# Altium project mb1225.PrjPCB (part 1 of 4)
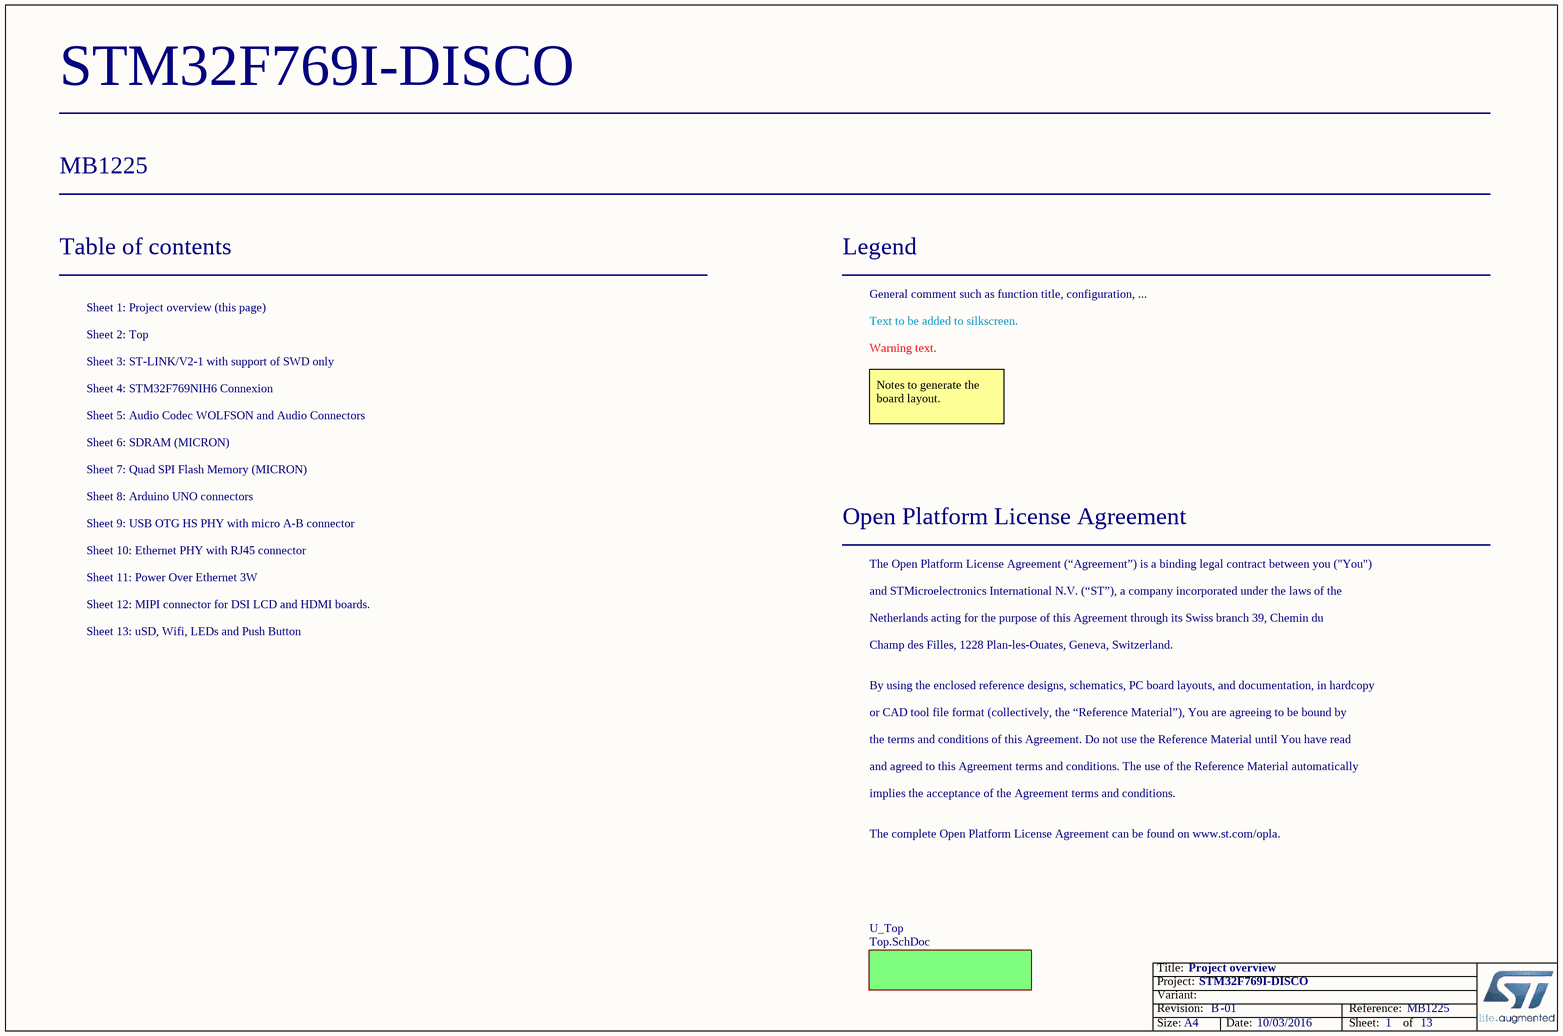
[diagram p0: Project_Overview.SchDoc]
Board_Assembly_Revision: 01; Board_Document_Date: 10/03/2016; Board_name: STM32F769I-DISCO; Board_PCB_Revision: B; Board_reference: MB1225
13 sheets, 452 parts. Net scope: flat (ports and power ports of the same name join across sheets).
Board file: mb1225.PcbDoc
Sheets:
  Project_Overview.SchDoc
    U_Top = Top.SchDoc
      U_ST_LINK_V2-1 = ST_LINK_V2-1.SCHDOC
      U_AUDIO = AUDIO.SchDoc
      U_Peripherals = Peripherals.SchDoc
      U_QSPI = QSPI.SchDoc
      U_Arduino_ Connectors = Arduino_ Connectors.SchDoc
      U_SDRAM = SDRAM.SchDoc
      U_USB_OTG_HS = USB_OTG_HS.SchDoc
      U_STM32F7 = STM32F7.SchDoc
      U_Ethernet = Ethernet.SchDoc
        U_PoE = PoE.SchDoc
      U_DSI_LCD = DSI_LCD.SchDoc

## Sheet Project_Overview.SchDoc: Project overview
size A4; Date: Not used; ApprovedBy: Not used; CheckedBy: Not used; Author: Not used; CompanyName: STMicroelectronics; DrawnBy: Not used; Engineer: Not used; Organization: Not used; Address1: Not used; Address2: Not used; Address3: Not used; Address4: Not used; DocumentNumber: MB1225; Revision: Not used; SheetNumber: 1; SheetTotal: 13; CurrentTime: Not used; CurrentDate: Not used; Time: Not used; DocumentFullPathAndName: Not used; DocumentName: Not used; ModifiedDate: Not used; ImagePath: Not used; ProjectName: Not used; Application_BuildNumber: Not used

### Sub-sheets
U_Top = Top.SchDoc: no entries

### Notes on the sheet
- Table of contents
- Sheet 1: Project overview (this page)
- Legend
- General comment such as function title, configuration, ...
- Sheet 2: Top
- Sheet 3: ST-LINK/V2-1 with support of SWD only
- Text to be added to silkscreen.
- Warning text.
- Sheet 4: STM32F769NIH6 Connexion
- Sheet 6: SDRAM (MICRON)
- Sheet 5: Audio Codec WOLFSON and Audio Connectors
- Notes to generate the board layout.
- Sheet 7: Quad SPI Flash Memory (MICRON)
- Sheet 8: Arduino UNO connectors
- Sheet 9: USB OTG HS PHY with micro A-B connector
- Sheet 10: Ethernet PHY with RJ45 connector
- Sheet 11: Power Over Ethernet 3W
- Open Platform License Agreement
- The Open Platform License Agreement (“Agreement”) is a binding legal contract between you ("You")
- Sheet 12: MIPI connector for DSI LCD and HDMI boards.
- Sheet 13: uSD, Wifi, LEDs and Push Button
- and STMicroelectronics International N.V. (“ST”), a company incorporated under the laws of the
- Netherlands acting for the purpose of this Agreement through its Swiss branch 39, Chemin du
- Champ des Filles, 1228 Plan-les-Ouates, Geneva, Switzerland.
- By using the enclosed reference designs, schematics, PC board layouts, and documentation, in hardcopy
- or CAD tool file format (collectively, the “Reference Material”), You are agreeing to be bound by
- the terms and conditions of this Agreement. Do not use the Reference Material until You have read
- and agreed to this Agreement terms and conditions. The use of the Reference Material automatically
- implies the acceptance of the Agreement terms and conditions.
- The complete Open Platform License Agreement can be found on www.st.com/opla.
- Title:
- Project:
- Size:
- Revision:
- Variant:
- A4
- -
- Date:
- Reference:
- Sheet:
- of

## Sheet Top.SchDoc: STM32F769 Discovery Interconnexion
size A4; Date: 29-OCT-2015; Author: A.B; CompanyName: STMicroelectronics; Organization: MCD/TOOLS/GNB; Address1: 12, Rue Jules HOROWITZ; Address2: 38019 Grenoble; Address3: FRANCE; DocumentNumber: MB1225; Revision: B-01; SheetNumber: 2; SheetTotal: 13; Project: STM32F769I-DISCO
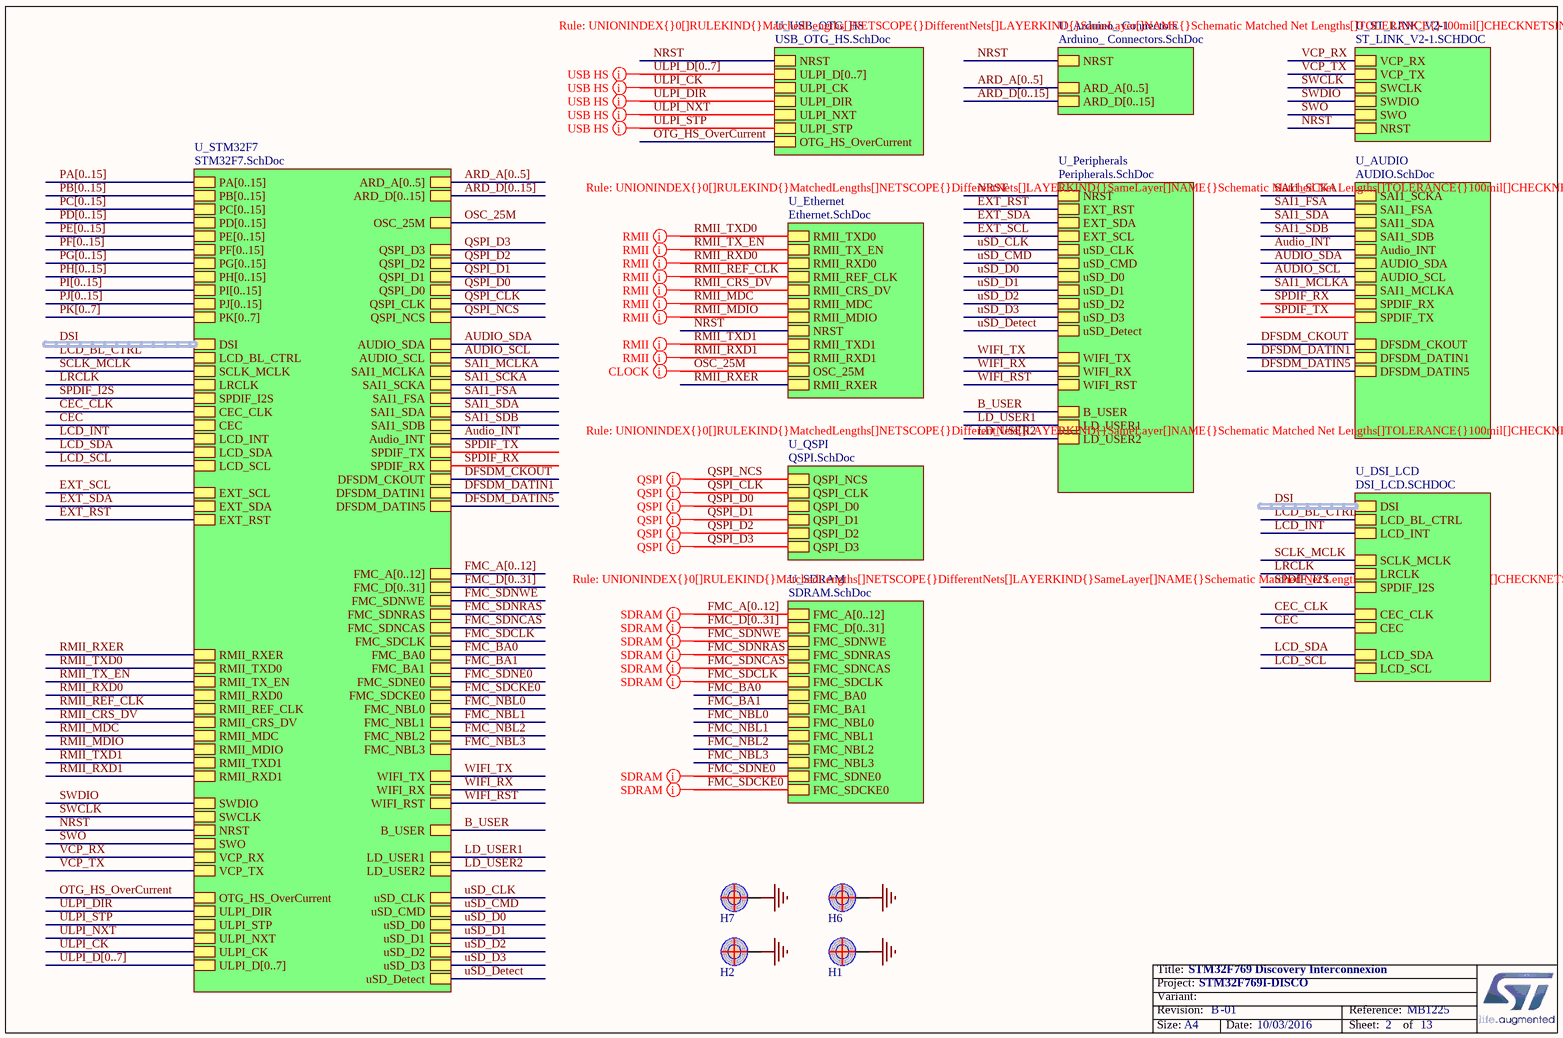
[diagram p1: Top.SchDoc]

### Parts
H1  POSITION HOLE C6D3R5  [HOLE_C6D3R5]  (value not drawn)
H2  POSITION HOLE C6D3R5  [HOLE_C6D3R5]  (value not drawn)
H6  POSITION HOLE C6D3R5  [HOLE_C6D3R5]  (value not drawn)
H7  POSITION HOLE C6D3R5  [HOLE_C6D3R5]  (value not drawn)

### Sub-sheets
U_Arduino_ Connectors = Arduino_ Connectors.SchDoc: NRST, ARD_D[0..15], ARD_A[0..5]
U_AUDIO = AUDIO.SchDoc: AUDIO_SDA, AUDIO_SCL, SAI1_MCLKA, SPDIF_RX, SAI1_SCKA, SAI1_FSA, SAI1_SDA, SAI1_SDB, Audio_INT, SPDIF_TX, DFSDM_CKOUT, DFSDM_DATIN1, DFSDM_DATIN5
U_DSI_LCD = DSI_LCD.SCHDOC: DSI (harness DSI), LCD_INT, LCD_BL_CTRL, SCLK_MCLK, LRCLK, SPDIF_I2S, CEC_CLK, CEC, LCD_SDA, LCD_SCL
U_Ethernet = Ethernet.SchDoc: RMII_TXD0, RMII_TX_EN, RMII_RXD0, RMII_REF_CLK, RMII_CRS_DV, RMII_MDC, RMII_MDIO, NRST, RMII_TXD1, RMII_RXD1, OSC_25M, RMII_RXER
U_Peripherals = Peripherals.SchDoc: NRST, EXT_RST, EXT_SCL, EXT_SDA, uSD_CLK, uSD_CMD, uSD_D0, uSD_D1, uSD_D2, uSD_D3, uSD_Detect, B_USER, WIFI_TX, WIFI_RX, WIFI_RST, LD_USER1, LD_USER2
U_QSPI = QSPI.SchDoc: QSPI_D0, QSPI_D3, QSPI_D1, QSPI_CLK, QSPI_NCS, QSPI_D2
U_SDRAM = SDRAM.SchDoc: FMC_A[0..12], FMC_SDNWE, FMC_SDNRAS, FMC_SDNCAS, FMC_SDCLK, FMC_BA0, FMC_BA1, FMC_NBL0, FMC_NBL1, FMC_SDNE0, FMC_SDCKE0, FMC_D[0..31], FMC_NBL2, FMC_NBL3
U_ST_LINK_V2-1 = ST_LINK_V2-1.SCHDOC: SWDIO, SWCLK, NRST, VCP_RX, VCP_TX, SWO
U_STM32F7 = STM32F7.SchDoc: PA[0..15], PB[0..15], PC[0..15], PD[0..15], PE[0..15], PF[0..15], PG[0..15], PH[0..15], PI[0..15], PJ[0..15], PK[0..7], OSC_25M, RMII_TXD0, RMII_TX_EN, RMII_RXD0, RMII_REF_CLK, RMII_CRS_DV, RMII_MDC, RMII_MDIO, RMII_TXD1, RMII_RXD1, ULPI_D[0..7], ULPI_CK, ULPI_DIR, ULPI_NXT, ULPI_STP, QSPI_D0, QSPI_D3, QSPI_D1, QSPI_CLK, QSPI_NCS, AUDIO_SDA, AUDIO_SCL, SAI1_MCLKA, EXT_SCL, EXT_SDA, EXT_RST, uSD_CLK, uSD_CMD, uSD_D0, uSD_D1, uSD_D2, uSD_D3, uSD_Detect, SWDIO, SWCLK, NRST, SWO, VCP_RX, VCP_TX, FMC_A[0..12], FMC_D[0..31], FMC_SDNWE, FMC_SDNRAS, FMC_SDNCAS, FMC_SDCLK, FMC_BA0, FMC_BA1, FMC_SDNE0, FMC_SDCKE0, FMC_NBL0, FMC_NBL1, SPDIF_RX, QSPI_D2, B_USER, ARD_D[0..15], RMII_RXER, OTG_HS_OverCurrent, SAI1_SCKA, SAI1_FSA, SAI1_SDA, SAI1_SDB, Audio_INT, SPDIF_TX, FMC_NBL2, FMC_NBL3, DSI (harness DSI), LCD_BL_CTRL, SCLK_MCLK, LRCLK, SPDIF_I2S, CEC_CLK, CEC, LCD_INT, LCD_SDA, LCD_SCL, WIFI_RST, WIFI_RX, WIFI_TX, ARD_A[0..5], LD_USER1, LD_USER2, DFSDM_CKOUT, DFSDM_DATIN1, DFSDM_DATIN5
U_USB_OTG_HS = USB_OTG_HS.SchDoc: ULPI_D[0..7], ULPI_CK, ULPI_DIR, ULPI_NXT, ULPI_STP, NRST, OTG_HS_OverCurrent

### Nets
GND: H1.1 H2.1 H6.1 H7.1  [project net POE7]
Audio_INT: sheet U_AUDIO/Audio_INT, sheet U_STM32F7/Audio_INT
AUDIO_SCL: sheet U_AUDIO/AUDIO_SCL, sheet U_STM32F7/AUDIO_SCL
AUDIO_SDA: sheet U_AUDIO/AUDIO_SDA, sheet U_STM32F7/AUDIO_SDA
B_USER: sheet U_Peripherals/B_USER, sheet U_STM32F7/B_USER
CEC: sheet U_STM32F7/CEC, sheet U_DSI_LCD/CEC
CEC_CLK: sheet U_STM32F7/CEC_CLK, sheet U_DSI_LCD/CEC_CLK
DFSDM_CKOUT: sheet U_AUDIO/DFSDM_CKOUT, sheet U_STM32F7/DFSDM_CKOUT
DFSDM_DATIN1: sheet U_AUDIO/DFSDM_DATIN1, sheet U_STM32F7/DFSDM_DATIN1
DFSDM_DATIN5: sheet U_AUDIO/DFSDM_DATIN5, sheet U_STM32F7/DFSDM_DATIN5
EXT_RST: sheet U_Peripherals/EXT_RST, sheet U_STM32F7/EXT_RST
EXT_SCL: sheet U_Peripherals/EXT_SCL, sheet U_STM32F7/EXT_SCL
EXT_SDA: sheet U_Peripherals/EXT_SDA, sheet U_STM32F7/EXT_SDA
FMC_BA0: sheet U_SDRAM/FMC_BA0, sheet U_STM32F7/FMC_BA0
FMC_BA1: sheet U_SDRAM/FMC_BA1, sheet U_STM32F7/FMC_BA1
FMC_NBL0: sheet U_SDRAM/FMC_NBL0, sheet U_STM32F7/FMC_NBL0
FMC_NBL1: sheet U_SDRAM/FMC_NBL1, sheet U_STM32F7/FMC_NBL1
FMC_NBL2: sheet U_SDRAM/FMC_NBL2, sheet U_STM32F7/FMC_NBL2
FMC_NBL3: sheet U_SDRAM/FMC_NBL3, sheet U_STM32F7/FMC_NBL3
FMC_SDCKE0: sheet U_SDRAM/FMC_SDCKE0, sheet U_STM32F7/FMC_SDCKE0
FMC_SDCLK: sheet U_SDRAM/FMC_SDCLK, sheet U_STM32F7/FMC_SDCLK
FMC_SDNCAS: sheet U_SDRAM/FMC_SDNCAS, sheet U_STM32F7/FMC_SDNCAS
FMC_SDNE0: sheet U_SDRAM/FMC_SDNE0, sheet U_STM32F7/FMC_SDNE0
FMC_SDNRAS: sheet U_SDRAM/FMC_SDNRAS, sheet U_STM32F7/FMC_SDNRAS
FMC_SDNWE: sheet U_SDRAM/FMC_SDNWE, sheet U_STM32F7/FMC_SDNWE
LCD_BL_CTRL: sheet U_STM32F7/LCD_BL_CTRL, sheet U_DSI_LCD/LCD_BL_CTRL
LCD_INT: sheet U_STM32F7/LCD_INT, sheet U_DSI_LCD/LCD_INT
LCD_SCL: sheet U_STM32F7/LCD_SCL, sheet U_DSI_LCD/LCD_SCL
LCD_SDA: sheet U_STM32F7/LCD_SDA, sheet U_DSI_LCD/LCD_SDA
LD_USER1: sheet U_Peripherals/LD_USER1, sheet U_STM32F7/LD_USER1
LD_USER2: sheet U_Peripherals/LD_USER2, sheet U_STM32F7/LD_USER2
LRCLK: sheet U_STM32F7/LRCLK, sheet U_DSI_LCD/LRCLK
NRST: sheet U_ST_LINK_V2-1/NRST, sheet U_Peripherals/NRST, sheet U_Arduino_ Connectors/NRST, sheet U_USB_OTG_HS/NRST, sheet U_STM32F7/NRST, sheet U_Ethernet/NRST
OSC_25M: sheet U_STM32F7/OSC_25M, sheet U_Ethernet/OSC_25M
OTG_HS_OverCurrent: sheet U_USB_OTG_HS/OTG_HS_OverCurrent, sheet U_STM32F7/OTG_HS_OverCurrent
QSPI_CLK: sheet U_QSPI/QSPI_CLK, sheet U_STM32F7/QSPI_CLK
QSPI_D0: sheet U_QSPI/QSPI_D0, sheet U_STM32F7/QSPI_D0
QSPI_D1: sheet U_QSPI/QSPI_D1, sheet U_STM32F7/QSPI_D1
QSPI_D2: sheet U_QSPI/QSPI_D2, sheet U_STM32F7/QSPI_D2
QSPI_D3: sheet U_QSPI/QSPI_D3, sheet U_STM32F7/QSPI_D3
QSPI_NCS: sheet U_QSPI/QSPI_NCS, sheet U_STM32F7/QSPI_NCS
RMII_CRS_DV: sheet U_STM32F7/RMII_CRS_DV, sheet U_Ethernet/RMII_CRS_DV
RMII_MDC: sheet U_STM32F7/RMII_MDC, sheet U_Ethernet/RMII_MDC
RMII_MDIO: sheet U_STM32F7/RMII_MDIO, sheet U_Ethernet/RMII_MDIO
RMII_REF_CLK: sheet U_STM32F7/RMII_REF_CLK, sheet U_Ethernet/RMII_REF_CLK
RMII_RXD0: sheet U_STM32F7/RMII_RXD0, sheet U_Ethernet/RMII_RXD0
RMII_RXD1: sheet U_STM32F7/RMII_RXD1, sheet U_Ethernet/RMII_RXD1
RMII_RXER: sheet U_STM32F7/RMII_RXER, sheet U_Ethernet/RMII_RXER
RMII_TX_EN: sheet U_STM32F7/RMII_TX_EN, sheet U_Ethernet/RMII_TX_EN
RMII_TXD0: sheet U_STM32F7/RMII_TXD0, sheet U_Ethernet/RMII_TXD0
RMII_TXD1: sheet U_STM32F7/RMII_TXD1, sheet U_Ethernet/RMII_TXD1
SAI1_FSA: sheet U_AUDIO/SAI1_FSA, sheet U_STM32F7/SAI1_FSA
SAI1_MCLKA: sheet U_AUDIO/SAI1_MCLKA, sheet U_STM32F7/SAI1_MCLKA
SAI1_SCKA: sheet U_AUDIO/SAI1_SCKA, sheet U_STM32F7/SAI1_SCKA
SAI1_SDA: sheet U_AUDIO/SAI1_SDA, sheet U_STM32F7/SAI1_SDA
SAI1_SDB: sheet U_AUDIO/SAI1_SDB, sheet U_STM32F7/SAI1_SDB
SCLK_MCLK: sheet U_STM32F7/SCLK_MCLK, sheet U_DSI_LCD/SCLK_MCLK
SPDIF_I2S: sheet U_STM32F7/SPDIF_I2S, sheet U_DSI_LCD/SPDIF_I2S
SPDIF_RX: sheet U_AUDIO/SPDIF_RX, sheet U_STM32F7/SPDIF_RX
SPDIF_TX: sheet U_AUDIO/SPDIF_TX, sheet U_STM32F7/SPDIF_TX
SWCLK: sheet U_ST_LINK_V2-1/SWCLK, sheet U_STM32F7/SWCLK
SWDIO: sheet U_ST_LINK_V2-1/SWDIO, sheet U_STM32F7/SWDIO
SWO: sheet U_ST_LINK_V2-1/SWO, sheet U_STM32F7/SWO
ULPI_CK: sheet U_USB_OTG_HS/ULPI_CK, sheet U_STM32F7/ULPI_CK
ULPI_DIR: sheet U_USB_OTG_HS/ULPI_DIR, sheet U_STM32F7/ULPI_DIR
ULPI_NXT: sheet U_USB_OTG_HS/ULPI_NXT, sheet U_STM32F7/ULPI_NXT
ULPI_STP: sheet U_USB_OTG_HS/ULPI_STP, sheet U_STM32F7/ULPI_STP
uSD_CLK: sheet U_Peripherals/uSD_CLK, sheet U_STM32F7/uSD_CLK
uSD_CMD: sheet U_Peripherals/uSD_CMD, sheet U_STM32F7/uSD_CMD
uSD_D0: sheet U_Peripherals/uSD_D0, sheet U_STM32F7/uSD_D0
uSD_D1: sheet U_Peripherals/uSD_D1, sheet U_STM32F7/uSD_D1
uSD_D2: sheet U_Peripherals/uSD_D2, sheet U_STM32F7/uSD_D2
uSD_D3: sheet U_Peripherals/uSD_D3, sheet U_STM32F7/uSD_D3
uSD_Detect: sheet U_Peripherals/uSD_Detect, sheet U_STM32F7/uSD_Detect
VCP_RX: sheet U_ST_LINK_V2-1/VCP_RX, sheet U_STM32F7/VCP_RX
VCP_TX: sheet U_ST_LINK_V2-1/VCP_TX, sheet U_STM32F7/VCP_TX
WIFI_RST: sheet U_Peripherals/WIFI_RST, sheet U_STM32F7/WIFI_RST
WIFI_RX: sheet U_Peripherals/WIFI_RX, sheet U_STM32F7/WIFI_RX
WIFI_TX: sheet U_Peripherals/WIFI_TX, sheet U_STM32F7/WIFI_TX

### Buses and harness runs
bus ARD_A[0..5] = sheet U_Arduino_ Connectors/ARD_A[0..5]
bus ARD_A[0..5] = sheet U_STM32F7/ARD_A[0..5]
bus ARD_D[0..15] = sheet U_Arduino_ Connectors/ARD_D[0..15]
bus ARD_D[0..15] = sheet U_STM32F7/ARD_D[0..15]
bus FMC_A[0..12] = sheet U_SDRAM/FMC_A[0..12]
bus FMC_A[0..12] = sheet U_STM32F7/FMC_A[0..12]
bus FMC_D[0..31] = sheet U_SDRAM/FMC_D[0..31]
bus FMC_D[0..31] = sheet U_STM32F7/FMC_D[0..31]
bus PA[0..15] = sheet U_STM32F7/PA[0..15]
bus PB[0..15] = sheet U_STM32F7/PB[0..15]
bus PC[0..15] = sheet U_STM32F7/PC[0..15]
bus PD[0..15] = sheet U_STM32F7/PD[0..15]
bus PE[0..15] = sheet U_STM32F7/PE[0..15]
bus PF[0..15] = sheet U_STM32F7/PF[0..15]
bus PG[0..15] = sheet U_STM32F7/PG[0..15]
bus PH[0..15] = sheet U_STM32F7/PH[0..15]
bus PI[0..15] = sheet U_STM32F7/PI[0..15]
bus PJ[0..15] = sheet U_STM32F7/PJ[0..15]
bus PK[0..7] = sheet U_STM32F7/PK[0..7]
bus ULPI_D[0..7] = sheet U_STM32F7/ULPI_D[0..7]
bus ULPI_D[0..7] = sheet U_USB_OTG_HS/ULPI_D[0..7]
harness DSI = sheet U_DSI_LCD/DSI
harness DSI = sheet U_STM32F7/DSI

### Layout directives
rule Matched Net Lengths [Tolerance = 100mil]: (no net found under the mark), FMC_SDCKE0, FMC_SDCLK, FMC_SDNCAS, FMC_SDNE0, FMC_SDNRAS, FMC_SDNWE, QSPI_CLK, QSPI_D0, QSPI_D1, QSPI_D2, QSPI_D3, QSPI_NCS, RMII_CRS_DV, RMII_MDC, RMII_MDIO, RMII_REF_CLK, RMII_RXD0, RMII_RXD1, RMII_TX_EN, RMII_TXD0, RMII_TXD1, ULPI_CK, ULPI_DIR, ULPI_NXT, ULPI_STP
rule Undefined: OSC_25M

### Notes on the sheet
- Title:
- Project:
- Size:
- Revision:
- Variant:
- A4
- -
- Date:
- Reference:
- Sheet:
- of

## Sheet ST_LINK_V2-1.SCHDOC: ST-LINK/V2-1 with support of SWD only
size A4; Date: 29-OCT-2015; Author: A.B; CompanyName: STMicroelectronics; Organization: MCD/TOOLS/GNB; Address1: 12, Rue Jules HOROWITZ; Address2: 38019 Grenoble; Address3: FRANCE; DocumentNumber: MB1225; Revision: B-01; SheetNumber: 3; SheetTotal: 13; Project: STM32F769I-DISCO
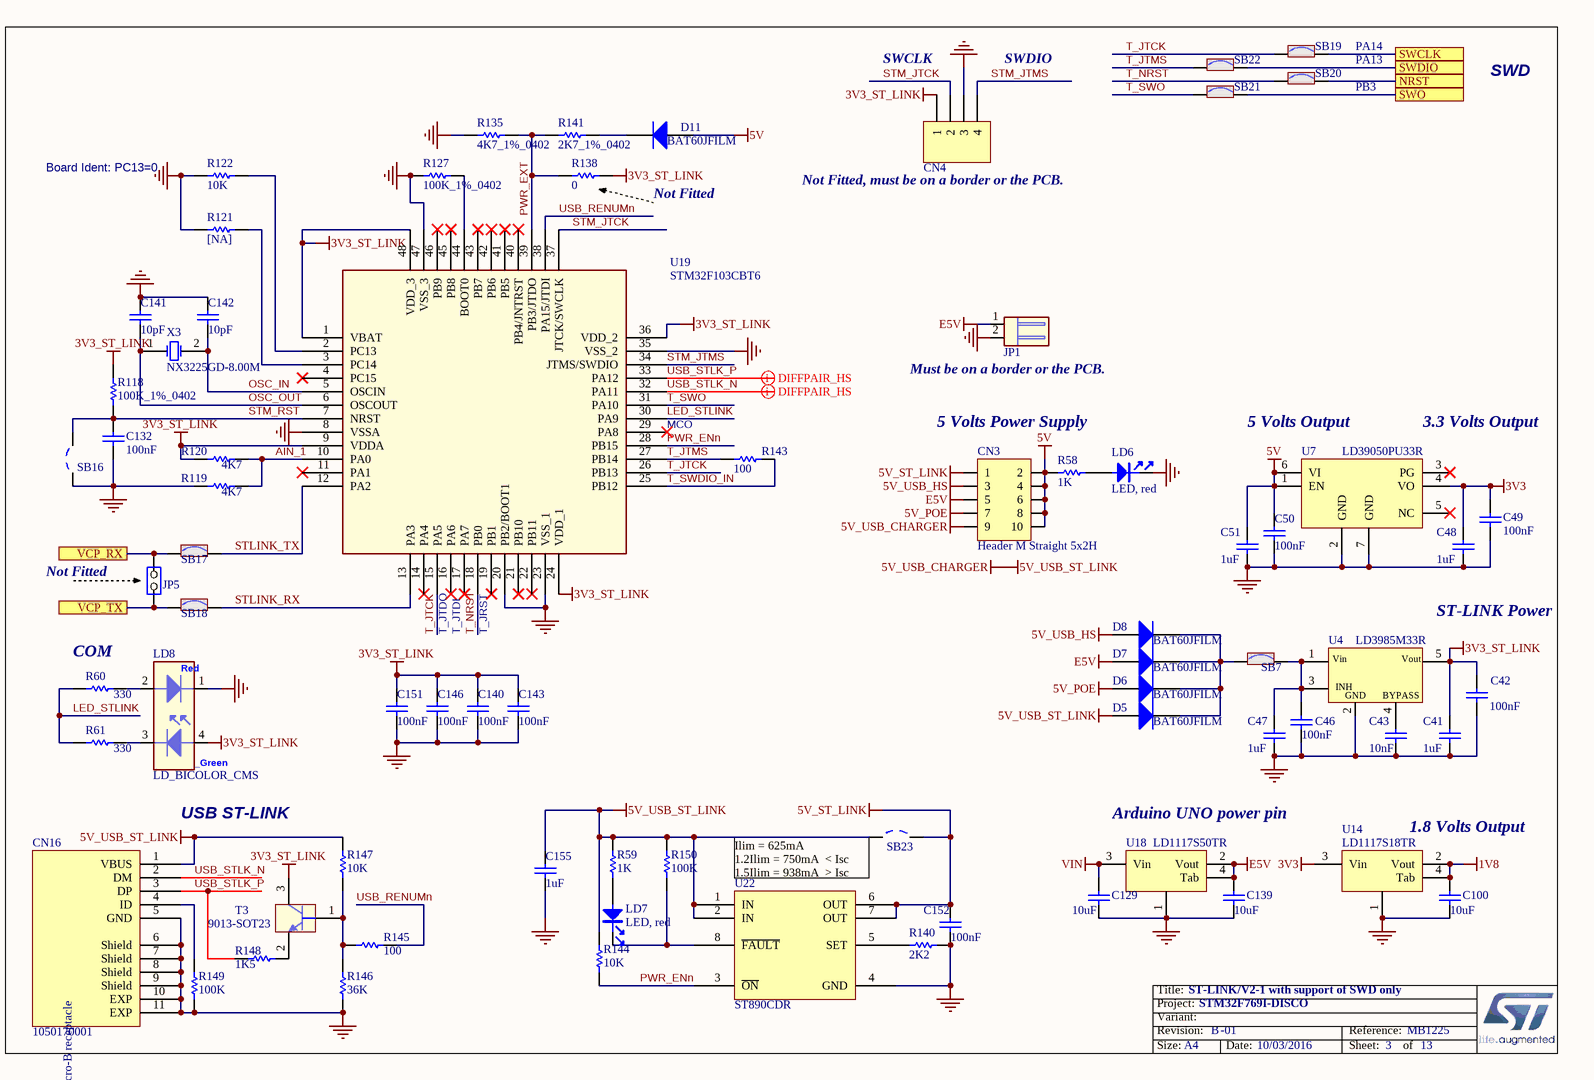
[diagram p2: ST_LINK_V2-1.SCHDOC]

### Parts
C41  1uF  [0603C]
C42  100nF  [0402C]
C43  10nF  [0603C]
C46  100nF  [0402C]
C47  1uF  [0603C]
C48  1uF  [0603C]
C49  100nF  [0402C]
C50  100nF  [0402C]
C51  1uF  [0603C]
C100  10uF  [0603C]
C129  10uF  [0805C]
C132  100nF  [0402C]
C139  10uF  [0805C]
C140  100nF  [0402C]
C141  10pF  [0402C]
C142  10pF  [0402C]
C143  100nF  [0402C]
C146  100nF  [0402C]
C151  100nF  [0402C]
C152  100nF  [0402C]
C155  1uF  [0603C]
CN3  Header M Straight 5x2H  [HDR_2X5_2R54]
CN4  Header 4  [HDR_1X4_2R54]  (value not drawn)
CN16  1050170001  [MICRO_USB_B_105017]
D5  BAT60JFILM  [SOD-323]
D6  BAT60JFILM  [SOD-323]
D7  BAT60JFILM  [SOD-323]
D8  BAT60JFILM  [SOD-323]
D11  BAT60JFILM  [SOD-323]
JP1  WF25402-06421  [HDR_1X2_2R54_RA_11R35]  (value not drawn)
JP5  JP2  [SIP2]  (value not drawn)
LD6  LED, red  [0603D]
LD7  LED, red  [0603D]
LD8  LD_BICOLOR_CMS  [LED2_3528]
R58  1K  [0402R]
R59  1K  [0402R]
R60  330  [0402R]
R61  330  [0402R]
R118  100K_1%_0402  [0402R]
R119  4K7  [0402R]
R120  4K7  [0402R]
R121  [NA]  [0402R]
R122  10K  [0402R]
R127  100K_1%_0402  [0402R]
R135  4K7_1%_0402  [0402R]
R138  0  [0402R]
R140  2K2  [0402R]
R141  2K7_1%_0402  [0402R]
R143  100  [0402R]
R144  10K  [0402R]
R145  100  [0402R]
R146  36K  [0402R]
R147  10K  [0402R]
R148  1K5  [0402R]
R149  100K  [0402R]
R150  100K  [0402R]
SB7  Solder Bridge ON  [JP2_SMD]  (value not drawn)
SB16  Solder Bridge OFF  [JP2_SMD]  (value not drawn)
SB17  Solder Bridge ON  [JP2_SMD]  (value not drawn)
SB18  Solder Bridge ON  [JP2_SMD]  (value not drawn)
SB19  Solder Bridge ON  [JP2_SMD]  (value not drawn)
SB20  Solder Bridge ON  [JP2_SMD]  (value not drawn)
SB21  Solder Bridge ON  [JP2_SMD]  (value not drawn)
SB22  Solder Bridge ON  [JP2_SMD]  (value not drawn)
SB23  Solder Bridge OFF  [JP2_SMD]  (value not drawn)
T3  9013-SOT23  [SOT-23]
U4  LD3985M33R  [SOT-23-5L]
U7  LD39050PU33R  [DFN6_0R95_3X3]
U14  LD1117S18TR  [SOT-223]
U18  LD1117S50TR  [SOT-223]
U19  STM32F103CBT6  [LQFP48_0R5_9X9]
U22  ST890CDR  [SOIC8_1R27_4R9X6]
X3  NX3225GD-8.00M  [XTAL_2SM_3R2X2R5_H1]

### Ports
NRST, SWCLK, SWDIO, SWO, VCP_RX, VCP_TX

### Nets
1V8: C100.2 U14.2(Vout) U14.4(Tab)
3V3: C48.2 C49.2 U7.4(VO) U14.3(Vin)
3V3_ST_LINK: C41.1 C42.2 C140.1 C143.2 C146.2 C151.2 CN4.1 LD8.4 R118.2 R120.1 R138.2 T3.3(C) U4.5(Vout) U19.1(VBAT) U19.9(VDDA) U19.24(VDD_1) U19.36(VDD_2) U19.48(VDD_3)
5V: C50.2 C51.2 CN3.2 CN3.4 CN3.6 CN3.8 CN3.10 D11.1(A) R58.1 U7.1(EN) U7.6(VI)
5V_POE: CN3.7 D6.1(A)
5V_ST_LINK: C152.2 CN3.1 SB23.2 U22.6(OUT) U22.7(OUT)
5V_USB_CHARGER: C155.2 CN3.9 CN16.1(VBUS) D5.1(A) R59.2 R144.2 R147.2 R150.2 SB23.1 U22.1(IN) U22.2(IN)  [also labelled 5V_USB_ST_LINK]
5V_USB_HS: CN3.3 D8.1(A)
E5V: C139.2 CN3.5 D7.1(A) JP1.1 U18.2(Vout) U18.4(Tab)
GND: C41.2 C42.1 C43.1 C46.1 C47.1 C48.1 C49.1 C50.1 C51.1 C100.1 C129.1 C132.1 C139.1 C140.2 C141.1 C142.1 C143.1 C146.1 C151.1 C152.1 C155.1 CN4.3 CN16.5(GND) CN16.6(Shield) CN16.7(Shield) CN16.8(Shield) CN16.9(Shield) CN16.10(EXP) CN16.11(EXP) JP1.2 LD6.2 LD8.1 R119.1 R121.1 R122.1 R127.1 R135.1 R140.2 R146.1 R149.1 SB16.1 U4.2(GND) U7.2(GND) U7.7(GND) U14.1 U18.1 U19.8(VSSA) U19.20(PB2/BOOT1) U19.23(VSS_1) U19.35(VSS_2) U19.47(VSS_3) U22.4(GND)  [project net POE7]
VIN: C129.2 U18.3(Vin)
AIN_1: R119.2 R120.2 U19.10(PA0)
LED_STLINK: R60.1 R61.1 U19.30(PA9)
NRST: SB20.2 ; port NRST
OSC_IN: C142.2 U19.5(OSCIN) X3.2(OSC2)
OSC_OUT: C141.2 U19.6(OSCOUT) X3.1(OSC1)
PA9: JP5.1(COMMON) SB18.1 ; port VCP_TX
PA10: JP5.2(NO) SB17.1 ; port VCP_RX
PA13: SB22.2 ; port SWDIO
PA14: SB19.2 ; port SWCLK
PWR_ENn: R144.1 U19.28(PB15) U22.3(~{ON})
PWR_EXT: R135.2 R138.1 R141.1 U19.39(PB3/JTDO)
STLINK_RX: SB18.2 U19.13(PA3)
STLINK_TX: SB17.2 U19.12(PA2)
STM_JTCK: CN4.2 U19.37(JTCK/SWCLK)
STM_JTMS: CN4.4 U19.34(JTMS/SWDIO)
STM_RST: C132.2 R118.1 SB16.2 U19.7(NRST)
SWO: SB21.2 ; port SWO
T_JTCK: SB19.1 U19.15(PA5) U19.26(PB13)
T_JTMS: R143.1 SB22.1 U19.27(PB14)
T_NRST: SB20.1 U19.18(PB0)
T_SWDIO_IN: R143.2 U19.25(PB12)
T_SWO: SB21.1 U19.31(PA10)
USB_RENUMn: R145.2 U19.38(PA15/JTDI)
USB_STLK_N: CN16.2(DM) U19.32(PA11)
USB_STLK_P: CN16.3(DP) R148.1 U19.33(PA12)
NetC43_2: C43.2 U4.4(BYPASS)
NetC46_2: C46.2 C47.2 SB7.2 U4.1(Vin) U4.3(CE)
NetCN16_4: CN16.4(ID) R149.2
NetD5_2: D5.2(K) D6.2(K) D7.2(K) D8.2(K) SB7.1
NetD11_2: D11.2(K) R141.2
NetLD6_1: LD6.1 R58.2
NetLD7_1: LD7.1 R59.1
NetLD7_2: LD7.2 R150.1 U22.8(~{FAULT})
NetLD8_2: LD8.2 R60.2
NetLD8_3: LD8.3 R61.2
NetR121_2: R121.2 U19.3(PC14)
NetR122_2: R122.2 U19.2(PC13)
NetR127_2: R127.2 U19.44(BOOT0)
NetR140_1: R140.1 U22.5(SET)
NetR145_1: R145.1 R146.2 R147.1 T3.1(B)
NetR148_2: R148.2 T3.2(E)

Not connected (* = marked no-connect by the designer): U7 3(PG)* 5(NC)*; U19 4(PC15)* 11(PA1)* 14(PA4)* 16(PA6)* 17(PA7)* 19(PB1)* 21(PB10)* 22(PB11)* 29(PA8)* 40(PB4/JNTRST)* 41(PB5)* 42(PB6)* 43(PB7)* 45(PB8)* 46(PB9)*

### Layout directives
differential pair: USB_STLK_N, USB_STLK_P

### Notes on the sheet
- SWCLK
- SWDIO
- PA14
- PA13
- PB3
- SWD
- Board Ident: PC13=0
- Not Fitted
- (near CN4) Not Fitted, must be on a border or the PCB.
- (near JP1) Must be on a border or the PCB.
- MCO
- 5 Volts Power Supply
- (near U7) 5 Volts Output
- (near U7) 3.3 Volts Output
- (near JP5) Not Fitted
- (near R60) COM
- T_JTDO
- T_JTDI
- T_JRST
- ST-LINK Power
- USB ST-LINK
- (near SB23) Ilim = 625mA
  1.2Ilim = 750mA  < Isc
  1.5Ilim = 938mA  > Isc
- Arduino UNO power pin
- (near U14) 1.8 Volts Output
- Title:
- Project:
- Size:
- Revision:
- Variant:
- A4
- -
- Date:
- Reference:
- Sheet:
- of
- (in symbol 1050170001) USB_Micro-B receptacle
- (in symbol LD3985M33R) INH
- (in symbol LD_BICOLOR_CMS) Red; _Green

### Library data of the parts
C41 C47 C48 C51 C155 = Cap_1uF_X5R_10%_0603: Capacitor,1uF,16V,X5R,10%,0603,YAGEO; Manuf_Part_1: CC0603KRX5R7BB105; Revision: July-2002: Re-released for DXP Platform.; Value: 1uF; Order: CC0603KRX5R7BB105; Manuf_1: YAGEO
  C155: ECCN_US/EU: n/a
C42 C46 C49 C50 C132 C140 C143 C146 C151 C152 = Cap_100nF_X7R_10%_0402: Capacitor,100nF,16V,X7R,10%,0402,YAGEO; Manuf_Part_1: CC0402KRX7R7BB104; Revision: July-2002: Re-released for DXP Platform.; Value: 100nF; Order: CC0402KRX7R7BB104; Manuf_1: YAGEO
C43 = Cap_10nF_X7R_10%_0603: Capacitor,10nF,50V,X7R,10%,0603,YAGEO; Manuf_Part_1: CC0603KRX7R9BB103; Revision: July-2002: Re-released for DXP Platform.; Value: 10nF; Order: CC0603KRX7R9BB103; Manuf_1: YAGEO
C100 = Cap_10uF_X5R_10%_0603: Capacitor,10uF,6.3V,X5R,10%,0603,YAGEO; Manuf_Part_1: CC0603KRX5R5BB106; Revision: July-2002: Re-released for DXP Platform.; Value: 10uF; Order: CC0603KRX5R5BB106; Manuf_1: YAGEO; ECCN_US/EU: n/a
C129 C139 = Cap_10uF_X5R_10%_0805: Capacitor,10uF,25V,X5R,10%,0805,YAGEO; Manuf_Part_1: CC0805KRX5R8BB106; Revision: July-2002: Re-released for DXP Platform.; Value: 10uF; Order: CC0805KRX5R8BB106; Manuf_1: YAGEO; ECCN_US/EU: n/a
C141 C142 = Cap_10pF_NPO_5%_0402: Capacitor,10pF,50V,NPO,5%,0402,YAGEO; Order: CC0402JRNPO9BN100; Revision: July-2002: Re-released for DXP Platform.; Value: 10pF; Manuf_1: YAGEO; Manuf_Part_1: CC0402JRNPO9BN100; ECCN_US/EU: n/a
CN3 = Header 5X2M: Header Male, 5-Pin, Dual row, Straight, AMD; Manuf_Part_1: 826632-5; Manuf_1: AMD; Distrib: Sub Co; Footprint: HDR2X5H; ECCN_US/EU: n/a; SOFER_FP: HDR_2X5_2R54
CN4 = Header 4: Header, 4-Pin; Fitted: NO; Revision: 17-Jul-2002: Re-released for DXP Platform.; Publisher: Altium Limited; ECCN_US/EU: n/a; SOFER_FP: HDR_1X4_2R54
CN16 = 1050170001: USB-MICRO-B, 1050170001, SMT, MOLEX; ECCN_US/EU: n/a; Manuf_1: MOLEX; Manuf_Part_1: 1050170001; Distrib: DIGIKEY; SOFER_FP: MICRO_USB_B_105017
D5-D8 D11 = BAT60JFILM: Manuf_1: STM; Provided: ST; ECCN_US/EU: EAR99/NEC; Ref St: 9151097; Revision: July-2002: Re-released for DXP Platform.; Order: BAT60JFILM; Manuf_Part_1: BAT60JFILM; Distrib: ST
JP1 = JP2_RA: Header, 2-Pins, Single row, Right Angle, 2.54 mm pitch, DIP; Manuf_1: ATOM; ECCN_US/EU: n/a; Manuf_Part_1: WF25402-06421; Distrib: Sub Co
JP5 = JP2: Fitted: NO; ECCN_US/EU: n/a
LD6 LD7 = LED_red: LED, red, 0603; Manuf_1: everlight; Manuf_Part_1: 19-213-R6C-AP1Q2B/3T; ECCN_US/EU: EAR99/NEC; Order: 19-213-R6C-AP1Q2B/3T
LD8 = LD_BICOLOR_CMS: Bicolor Led; Manuf_Part_1: HSMF-A201-A00J1; Manuf_1: Avago Technologies; Manuf_2: everluck; Manuf_Part_2: LE-RGW35280; Ref St: xxxxxx; ECCN_US/EU: EAR99/NEC; Distrib: RADIOSPARES; Footprint: HSMF-A201
R58 R59 = Res_1K_1%_0402: Resistor,1K,0402,1%,YAGEO; Manuf_Part_1: RC0402FR-071KL; Value: 1K; Manuf_1: YAGEO; Order: RC0402FR-071KL; ECCN_US/EU: n/a
R60 R61 = Res_330_1%_0402: Resistor,330,0402,1%,YAGEO; Manuf_Part_1: RC0402FR-07330RL; Value: 330; ECCN_US/EU: n/a; Manuf_1: YAGEO; Distrib: DIGIKEY; Order: RC0402FR-07330RL
R118 R127 R149 R150 = Res_100K_1%_0402: Resistor,100K,0402,1%,YAGEO; Manuf_Part_1: RC0402FR-07100KL; Manuf_Part_2: RT0402FRE07100KL; Value: 100K; Manuf_1: YAGEO; ECCN_US/EU: n/a; Manuf_2: YAGEO
R119 R120 R135 = Res_4K7_1%_0402: Resistor,4K7,0402,1%,YAGEO; Manuf_Part_1: RC0402FR-074K7L; Manuf_Part_2: RT0402FRE074K7L; Value: 4K7; Manuf_1: YAGEO; ECCN_US/EU: n/a; Manuf_2: YAGEO
R121 = Res_NA_0402: Resistor,[NA],0402; Fitted: NO; Value: [NA]; ECCN_US/EU: n/a
R122 R144 R147 = Res_10K_1%_0402: Resistor,10K,0402,1%,YAGEO; Manuf_Part_1: RC0402FR-0710KL; Value: 10K; Manuf_1: YAGEO; Order: RC0402FR-0710KL; ECCN_US/EU: n/a
R138 = Res_0_5%_0402: Resistor,0,0402,5%,YAGEO; Manuf_Part_1: RC0402JR-070RL; Order: 2363467; Fitted: NO; Value: 0; ECCN_US/EU: n/a; Manuf_1: YAGEO; Distrib: FARNELL
R140 = Res_2K2_1%_0402: Resistor,2K2,0402,1%,YAGEO; Manuf_Part_1: RC0402FR-072K2L; Value: 2K2; Manuf_1: YAGEO; Order: RC0402FR-072K2L; ECCN_US/EU: n/a
R141 = Res_2K7_1%_0402: Resistor,2K7,0402,1%,YAGEO; Manuf_Part_1: RC0402FR-072K7L; Value: 2K7; Manuf_1: YAGEO; Order: RC0402FR-072K7L; ECCN_US/EU: n/a; Distrib: FARNELL
R143 R145 = Res_100_1%_0402: Resistor,100,0402,1%,YAGEO; Manuf_Part_1: RC0402FR-07100RL; Order: 9239111; Value: 100; Manuf_1: YAGEO; ECCN_US/EU: n/a; Distrib: FARNELL
R146 = Res_36K_1%_0402: Resistor,36K,0402,1%,YAGEO; Manuf_Part_1: RC0402FR-0736KL; Value: 36K; Manuf_1: YAGEO; Order: RC0402FR-0736KL; ECCN_US/EU: n/a; Distrib: FARNELL
R148 = Res_1K5_1%_0402: Resistor,1K5,0402,1%,YAGEO; Manuf_Part_1: RC0402FR-071K5L; Value: 1K5; Manuf_1: YAGEO; Order: RC0402FR-071K5L; ECCN_US/EU: n/a; Distrib: FARNELL
SB7 SB17-SB22 = SB_ON: Solder: YES; Revision: July-2002: Re-released for DXP Platform.; ECCN_US/EU: n/a
SB16 SB23 = SB_OFF: Solder: NO; Revision: July-2002: Re-released for DXP Platform.; ECCN_US/EU: n/a
T3 = 9013-SOT23: NPN Bipolar Transistor; Manuf_1: NXP; Manuf_Part_1: BSR14; Order: 1081310; ECCN_US/EU: EAR99/NEC; Revision: July-2002: Re-released for DXP Platform.; Distrib: FARNELL
U4 = LD3985M33R: Ultra low drop-low noise BiCMOS voltage, regulators low ESR capacitors compatible; Manuf_1: STM; Provided: ST; Ref St: 9176161; ECCN_US/EU: EAR99/NEC; Manuf_Part_1: LD3985M33R; Distrib: ST; Order: LD3985M33R
U7 = LD39050P: Ultra low drop-low , 500 mA low quiescent current; Manuf_1: STM; Provided: ST; ECCN_US/EU: EAR99/NEC; Ref St: xxxxxxxx; Distrib: ST; Manuf_Part_1: LD39050PU33R; Order: LD39050PU33R
U14 = LD1117S18TR: LOW DROP FIXED AND ADJUSTABLE POSITIVE VOLTAGE REGULATORS (1.8 Volts); Manuf_1: STM; Ref St: 9176180; ECCN_US/EU: EAR99/NEC; Provided: ST; Manuf_Part_1: LD1117S18TR; Order: LD1117S18TR; Distrib: ST
U18 = LD1117S50TR: IC REG LDO 5V 0.8A SOT223; Manuf_1: STM; Ordered by: ST; ECCN_US/EU: EAR99/NEC; Ref St: 9176133; Manuf_Part_1: LD1117S50TR; Distrib: ST; Order: LD1117S50TR; Provided: ST
U19 = STM32F103CBT6: Medium-density performance line ARM-based 32-bit MCU with 128KB Flash; Manuf_1: STM; Ref St: xxxxxxxx; Provided: ST; ECCN_US/EU: 3A991A2/NEC; Footprint: QFP48 7X7; Manuf_Part_1: STM32F103CBT6; Order: STM32F103CBT6; Distrib: ST
U22 = ST890CDR: 1.2 A current limited high-side power switch with thermal shutdown; Manuf_1: STM; ECCN_US/EU: EAR99/NEC; Provided: ST; Manuf_Part_1: ST890CDR; Distrib: ST; Footprint: SO-8
X3 = XTAL_8M_NX3225GD: Crystal 8Mhz, 8pF, -+50PPM, SMD; Manuf_1: NDK; Manuf_Part_1: NX3225GD 8MHz EXS00A-CG04874; Manuf_Part_2: NX3225GD-8.000M-STD-CRA-3; ECCN_US/EU: EAR99/NEC; NDK Ref: X3127326; Ref St: 9157029; Provided: ST; Order: NX3225GD 8MHz EXS00A-CG04874

## Sheet AUDIO.SchDoc: Audio Codec WOLFSON and Audio Connectors
size A4; Date: 29-OCT-2015; Author: A.B; CompanyName: STMicroelectronics; Organization: MCD/TOOLS/GNB; Address1: 12, Rue Jules HOROWITZ; Address2: 38019 Grenoble; Address3: FRANCE; DocumentNumber: MB1225; Revision: B-01; SheetNumber: 5; SheetTotal: 13; Project: STM32F769I-DISCO
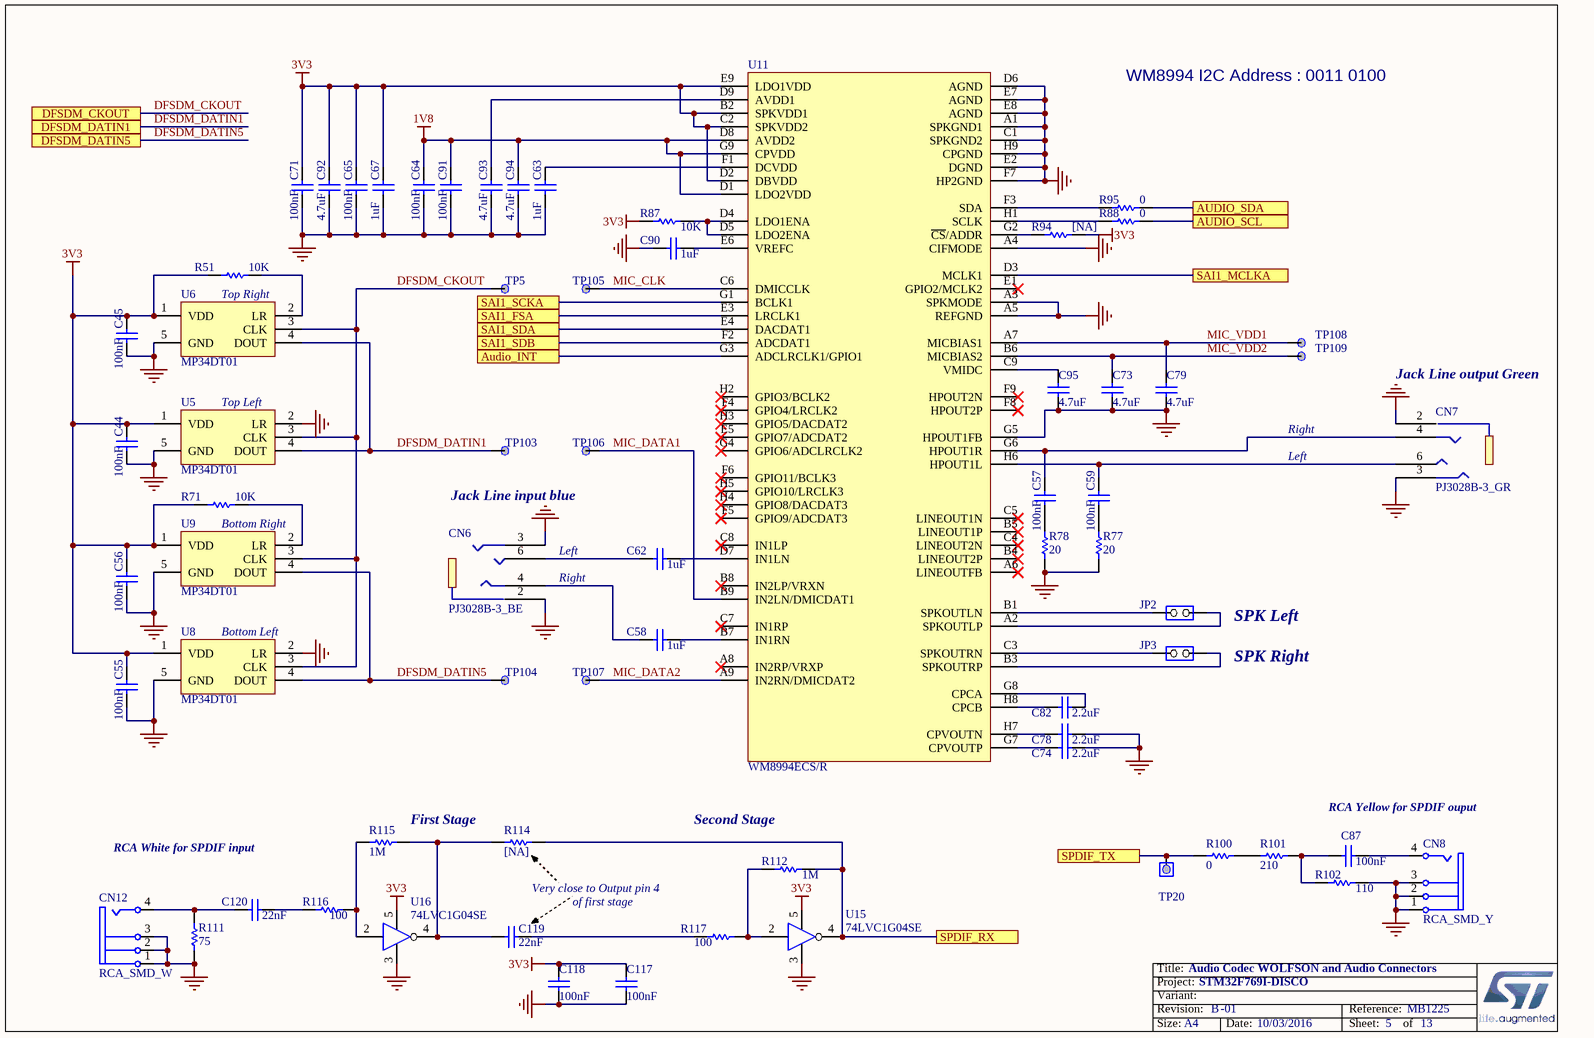
[diagram p3: AUDIO.SchDoc]

### Parts
C44  100nF  [0402C]
C45  100nF  [0402C]
C55  100nF  [0402C]
C56  100nF  [0402C]
C57  100nF  [0402C]
C58  1uF  [0603C]
C59  100nF  [0402C]
C62  1uF  [0603C]
C63  1uF  [0603C]
C64  100nF  [0402C]
C65  100nF  [0402C]
C67  1uF  [0603C]
C71  100nF  [0402C]
C73  4.7uF  [0603C]
C74  2.2uF  [0603C]
C78  2.2uF  [0603C]
C79  4.7uF  [0603C]
C82  2.2uF  [0603C]
C87  100nF  [0402C]
C90  1uF  [0603C]
C91  100nF  [0402C]
C92  4.7uF  [0603C]
C93  4.7uF  [0603C]
C94  4.7uF  [0603C]
C95  4.7uF  [0603C]
C117  100nF  [0402C]
C118  100nF  [0402C]
C119  22nF  [0402C]
C120  22nF  [0402C]
CN6  PJ3028B-3_BE  [PJ3028B]
CN7  PJ3028B-3_GR  [PJ3028B]
CN8  RCA_SMD_Y  [PHONE_JACK_JBB0819100002]
CN12  RCA_SMD_W  [PHONE_JACK_JBB0819100002]
JP2  JP2  [SIP2]  (value not drawn)
JP3  JP2  [SIP2]  (value not drawn)
R51  10K  [0402R]
R71  10K  [0402R]
R77  20  [0402R]
R78  20  [0402R]
R87  10K  [0402R]
R88  0  [0402R]
R94  [NA]  [0402R]
R95  0  [0402R]
R100  0  [0402R]
R101  210  [0402R]
R102  110  [0402R]
R111  75  [0402R]
R112  1M  [0402R]
R114  [NA]  [0402R]
R115  1M  [0402R]
R116  100  [0402R]
R117  100  [0402R]
TP5  TP  [TP_C40]  (value not drawn)
TP20  Test point 1 pin with hole  [TP]  (value not drawn)
TP103  TP  [TP_C40]  (value not drawn)
TP104  TP  [TP_C40]  (value not drawn)
TP105  TP  [TP_C40]  (value not drawn)
TP106  TP  [TP_C40]  (value not drawn)
TP107  TP  [TP_C40]  (value not drawn)
TP108  TP  [TP_C40]  (value not drawn)
TP109  TP  [TP_C40]  (value not drawn)
U5  MP34DT01  [MP34DT01TR]
U6  MP34DT01  [MP34DT01TR]
U8  MP34DT01  [MP34DT01TR]
U9  MP34DT01  [MP34DT01TR]
U11  WM8994ECS/R  [BGA72_0R5_4R5X4]
U15  74LVC1G04SE  [SOT-353]
U16  74LVC1G04SE  [SOT-353]

### Ports
Audio_INT, AUDIO_SCL, AUDIO_SDA, DFSDM_CKOUT, DFSDM_DATIN1, DFSDM_DATIN5, SAI1_FSA, SAI1_MCLKA, SAI1_SCKA, SAI1_SDA, SAI1_SDB, SPDIF_RX, SPDIF_TX

### Nets
1V8: C64.1 C91.1 C94.1 U11.D1(LDO2VDD) U11.D8(AVDD2) U11.G9(CPVDD)
3V3: C44.1 C45.1 C55.1 C56.1 C65.1 C67.2 C71.1 C92.1 C117.2 C118.2 R51.2 R71.2 R87.2 R94.2 U5.1(VDD) U6.1(VDD) U8.1(VDD) U9.1(VDD) U11.B2(SPKVDD1) U11.C2(SPKVDD2) U11.D2(DBVDD) U11.E9(LDO1VDD) U15.5(VCC) U16.5(VCC)
GND: C44.2 C45.2 C55.2 C56.2 C63.1 C64.2 C65.2 C67.1 C71.2 C73.1 C74.2 C78.2 C79.1 C90.2 C91.2 C92.2 C93.2 C94.2 C95.1 C117.1 C118.1 CN6.2 CN6.3 CN7.2 CN7.3 CN8.1(Ground) CN8.2(Ground) CN8.3(Ground) CN12.1(Ground) CN12.2(Ground) CN12.3(Ground) R77.2 R78.2 R102.2 R111.1 U5.2(LR) U5.5(GND) U6.5(GND) U8.2(LR) U8.5(GND) U9.5(GND) U11.A1(SPKGND1) U11.A3(SPKMODE) U11.A4(CIFMODE) U11.A5(REFGND) U11.C1(SPKGND2) U11.D6(AGND) U11.E2(DGND) U11.E7(AGND) U11.E8(AGND) U11.F7(HP2GND) U11.G5(HPOUT1FB) U11.H9(CPGND) U15.3(GND) U16.3(GND)  [project net POE7]
Audio_INT: U11.G3(ADCLRCLK1/GPIO1) ; port Audio_INT
AUDIO_SCL: R88.1 ; port AUDIO_SCL
AUDIO_SDA: R95.1 ; port AUDIO_SDA
DFSDM_CKOUT: TP5.1 U5.3(CLK) U6.3(CLK) U8.3(CLK) U9.3(CLK) ; port DFSDM_CKOUT
DFSDM_DATIN1: TP103.1 U5.4(DOUT) U6.4(DOUT) ; port DFSDM_DATIN1
DFSDM_DATIN5: TP104.1 U8.4(DOUT) U9.4(DOUT) ; port DFSDM_DATIN5
MIC_CLK: TP105.1 U11.C6(DMICCLK)
MIC_DATA1: TP106.1 U11.B9(IN2LN/DMICDAT1)
MIC_DATA2: TP107.1 U11.A9(IN2RN/DMICDAT2)
MIC_VDD1: C79.2 TP108.1 U11.A7(MICBIAS1)
MIC_VDD2: C73.2 TP109.1 U11.B6(MICBIAS2)
PD11: R100.1 TP20.1(COMMON) ; port SPDIF_TX
PE3: U11.F2(ADCDAT1) ; port SAI1_SDB
PE4: U11.E3(LRCLK1) ; port SAI1_FSA
PE5: U11.G1(BCLK1) ; port SAI1_SCKA
PE6: U11.E4(DACDAT1) ; port SAI1_SDA
PG7: U11.D3(MCLK1) ; port SAI1_MCLKA
PG12: R112.2 R114.2 U15.4(Y) ; port SPDIF_RX
NetC57_1: C57.1 CN7.4 U11.G6(HPOUT1R)
NetC57_2: C57.2 R78.1
NetC58_1: C58.1 U11.B7(IN1RN)
NetC58_2: C58.2 CN6.4
NetC59_1: C59.1 CN7.6 U11.H6(HPOUT1L)
NetC59_2: C59.2 R77.1
NetC62_1: C62.1 U11.D7(IN1LN)
NetC62_2: C62.2 CN6.6
NetC63_2: C63.2 U11.F1(DCVDD)
NetC74_1: C74.1 U11.G7(CPVOUTP)
NetC78_1: C78.1 U11.H7(CPVOUTN)
NetC82_1: C82.1 U11.H8(CPCB)
NetC82_2: C82.2 U11.G8(CPCA)
NetC87_1: C87.1 R101.2 R102.1
NetC87_2: C87.2 CN8.4(Signal)
NetC90_1: C90.1 U11.E6(VREFC)
NetC93_1: C93.1 U11.D9(AVDD1)
NetC95_2: C95.2 U11.C9(VMIDC)
NetC119_1: C119.1 R114.1 R115.2 U16.4(Y)
NetC119_2: C119.2 R117.1
NetC120_1: C120.1 CN12.4(Signal) R111.2
NetC120_2: C120.2 R116.1
NetJP2_1: JP2.1(COMMON) U11.B1(SPKOUTLN)
NetJP2_2: JP2.2(NO) U11.A2(SPKOUTLP)
NetJP3_1: JP3.1(COMMON) U11.C3(SPKOUTRN)
NetJP3_2: JP3.2(NO) U11.B3(SPKOUTRP)
NetR51_1: R51.1 U6.2(LR)
NetR71_1: R71.1 U9.2(LR)
NetR87_1: R87.1 U11.D4(LDO1ENA) U11.D5(LDO2ENA)
NetR88_2: R88.2 U11.H1(SCLK)
NetR94_1: R94.1 U11.G2(~{CS}/ADDR)
NetR95_2: R95.2 U11.F3(SDA)
NetR100_2: R100.2 R101.1
NetR112_1: R112.1 R117.2 U15.2(A)
NetR115_1: R115.1 R116.2 U16.2(A)

Not connected (* = marked no-connect by the designer): U11 A6(LINEOUTFB)* A8(IN2RP/VRXP)* B4(LINEOUT2P)* B5(LINEOUT1P)* B8(IN2LP/VRXN)* C4(LINEOUT2N)* C5(LINEOUT1N)* C7(IN1RP)* C8(IN1LP)* E1(GPIO2/MCLK2)* E5(GPIO7/ADCDAT2)* F4(GPIO4/LRCLK2)* F5(GPIO9/ADCDAT3)* F6(GPIO11/BCLK3)* F8(HPOUT2P)* F9(HPOUT2N)* G4(GPIO6/ADCLRCLK2)* H2(GPIO3/BCLK2)* H3(GPIO5/DACDAT2)* H4(GPIO8/DACDAT3)* H5(GPIO10/LRCLK3)*; U15 1(NC); U16 1(NC)

### Notes on the sheet
- WM8994 I2C Address : 0011 0100
- Top Right
- (near CN7) Jack Line output Green
- (near U5) Top Left
- Right
- Jack Line input blue
- Left
- Bottom Right
- (near U8) Bottom Left
- SPK Left
- SPK Right
- RCA White for SPDIF input
- First Stage
- Second Stage
- RCA Yellow for SPDIF ouput
- Very close to Output pin 4
- of first stage
- Title:
- Project:
- Size:
- Revision:
- Variant:
- A4
- -
- Date:
- Reference:
- Sheet:
- of

### Library data of the parts
C44 C45 C55-C57 C59 C64 C65 C71 C87 C91 C117 C118 = Cap_100nF_X7R_10%_0402: as C42 on sheet ST_LINK_V2-1; Revision: July-2002: Re-released for DXP Platform.; Value: 100nF; Order: CC0402KRX7R7BB104; Manuf_1: YAGEO
  C44 C45 C55-C57 C59 C64 C65 C71 C91: ECCN_US/EU: n/a
C58 C62 C63 C67 C90 = Cap_1uF_X5R_10%_0603: as C41 on sheet ST_LINK_V2-1; Revision: July-2002: Re-released for DXP Platform.; Value: 1uF; Order: CC0603KRX5R7BB105; Manuf_1: YAGEO; ECCN_US/EU: n/a
C73 C79 C92-C95 = Cap_4.7uF_X5R_10%_0603: Capacitor,4.7uF,16V, X5R,10%,0603,YAGEO; Manuf_Part_1: CC0603KRX5R7BB475; Order: CC0603KRX5R7BB105; Revision: July-2002: Re-released for DXP Platform.; Value: 4.7uF; Manuf_1: YAGEO; ECCN_US/EU: n/a
C74 C78 C82 = Cap_2.2uF_X5R_10%_0603: Capacitor,2.2uF,10V, X5R,10%,0603,YAGEO; Manuf_Part_1: CC0603KRX5R6BB225; Manuf_Part_2: C0603C225K8PACTU; Manuf_2: KEMET; Revision: July-2002: Re-released for DXP Platform.; Value: 2.2uF; Order: *; Manuf_1: YAGEO; ECCN_US/EU: n/a
C119 C120 = Cap_22nF_X7R_10%_0402: Capacitor,22nF,16V,X7R,10%,0402,YAGEO; Manuf_Part_1: CC0402KRX7R7BB223; Revision: July-2002: Re-released for DXP Platform.; Value: 22nF; Order: CC0402KRX7R7BB223; Manuf_1: YAGEO; ECCN_US/EU: n/a
CN6 = PJ3028B-3_BE: Connector Jack Stereo 3.5mm, female SMT, Blue (Line input); Manuf_Part_2: PJ30280-3_BE; ECCN_US/EU: n/a; Manuf_Part_1: PJ3028B-3_BE; Manuf_1: http://ww.qiaod.com
CN7 = PJ3028B-3_GR: Connector Jack Stereo 3.5mm, female SMT, Green (Line output); Manuf_Part_2: PJ30280-3_GR; ECCN_US/EU: n/a; Manuf_Part_1: PJ3028B-3_GR; Manuf_1: http://ww.qiaod.com
CN8 = RCA_SMD_Y: RCA Phono Jack, Right Angle, SMD, Yellow; Manuf_Part_1: JBB0819100002; Manuf_1: JIUBABA; Manuf_2: CUI Inc; Manuf_Part_2: RCJ-014-SMT; Distrib: Sub Co; ECCN_US/EU: n/a
CN12 = RCA_SMD_W: RCA Phono Jack, Right Angle, SMD, White; Manuf_Part_1: JBB0819100004; Manuf_1: JIUBABA; Manuf_2: CUI Inc; Manuf_Part_2: RCJ-013-SMT; Distrib: Sub Co; ECCN_US/EU: n/a
JP2 JP3 = JP2: Fitted: NO; ECCN_US/EU: n/a
R51 R71 R87 = Res_10K_1%_0402: as R122 on sheet ST_LINK_V2-1; Value: 10K; Manuf_1: YAGEO; Order: RC0402FR-0710KL; ECCN_US/EU: n/a
R77 R78 = Res_20_1%_0402: Resistor,20,0402,1%,YAGEO; Manuf_Part_1: RC0402FR-0720RL; Value: 20; Manuf_1: YAGEO; Order: *; ECCN_US/EU: n/a
R88 R95 R100 = Res_0_5%_0402: Resistor,0,0402,5%,YAGEO; Manuf_Part_1: RC0402JR-070RL; Order: 2363467; Value: 0; ECCN_US/EU: n/a; Manuf_1: YAGEO; Distrib: FARNELL
R94 R114 = Res_NA_0402: Resistor,[NA],0402; Fitted: NO; Value: [NA]; ECCN_US/EU: n/a
R101 = Res_210_1%_0402: Resistor,210,0402,1%,YAGEO; Manuf_Part_1: RC0402FR-07210RL; Value: 210; Manuf_1: YAGEO; Order: *; ECCN_US/EU: n/a; Distrib: DIGIKEY
R102 = Res_110_1%_0402: Resistor,110,0402,1%,YAGEO; Manuf_Part_1: RC0402FR-07110RL; Value: 110; Manuf_1: YAGEO; Order: *; ECCN_US/EU: n/a; Distrib: Distrib
R111 = Res_75_1%_0402: Resistor,75,0402,1%,YAGEO; Manuf_Part_1: RC0402FR-0775RL; Order: 311-75.0LRTR-ND; Value: 75; Manuf_1: YAGEO; ECCN_US/EU: n/a; Distrib: DIGIKEY
R112 R115 = Res_1M_1%_0402: Resistor,1M,0402,1%,YAGEO; Manuf_Part_1: RC0402FR-071ML; Value: 1M; Manuf_1: YAGEO; Order: RC0402FR-071ML; ECCN_US/EU: n/a
R116 R117 = Res_100_1%_0402: as R143 on sheet ST_LINK_V2-1; Value: 100; Manuf_1: YAGEO; ECCN_US/EU: n/a; Distrib: FARNELL
TP5 TP103-TP109 = TP: Test Point; ECCN_US/EU: n/a
TP20 = TP1: Test Point; Fitted: NO; ECCN_US/EU: n/a
U5 U6 U8 U9 = MP34DT01: MEMS audio sensor, omnidirectional digital microphone; Manuf_1: STM; Manuf_Part_1: MP34DT01TR-M; Provided: ST; Ref St: 9188008; ECCN_US/EU: EAR99/NEC; Order: MP34DT01TR-M; Distrib: ST
U11 = WM8994ECS/R: Multi-Channel Audio Hub CODEC for Smartphones; Manuf_1: Cirrus Logic; ECCN_US/EU: EAR99/NEC; Manuf_Part_1: WM8994ECS/R; Distrib: Cirrus Logic
U15 U16 = 74LVC1G04SE: Single inverter gate with a standard push-pull output. (1.65V to 5.5V); Manuf_Part_1: 74LVC1G04SE-7; Manuf_1: DIODES; Order: 1845218; ECCN_US/EU: EAR99/NEC; Footprint: SOT353; Distrib: FARNELL

## Sheet Peripherals.SchDoc: uSD, Wifi, LEDs and Push Button
size A4; Date: 29-OCT-2015; Author: A.B; CompanyName: STMicroelectronics; Organization: MCD/TOOLS/GNB; Address1: 12, Rue Jules HOROWITZ; Address2: 38019 Grenoble; Address3: FRANCE; DocumentNumber: MB1225; Revision: B-01; SheetNumber: 13; SheetTotal: 13; Project: STM32F769I-DISCO
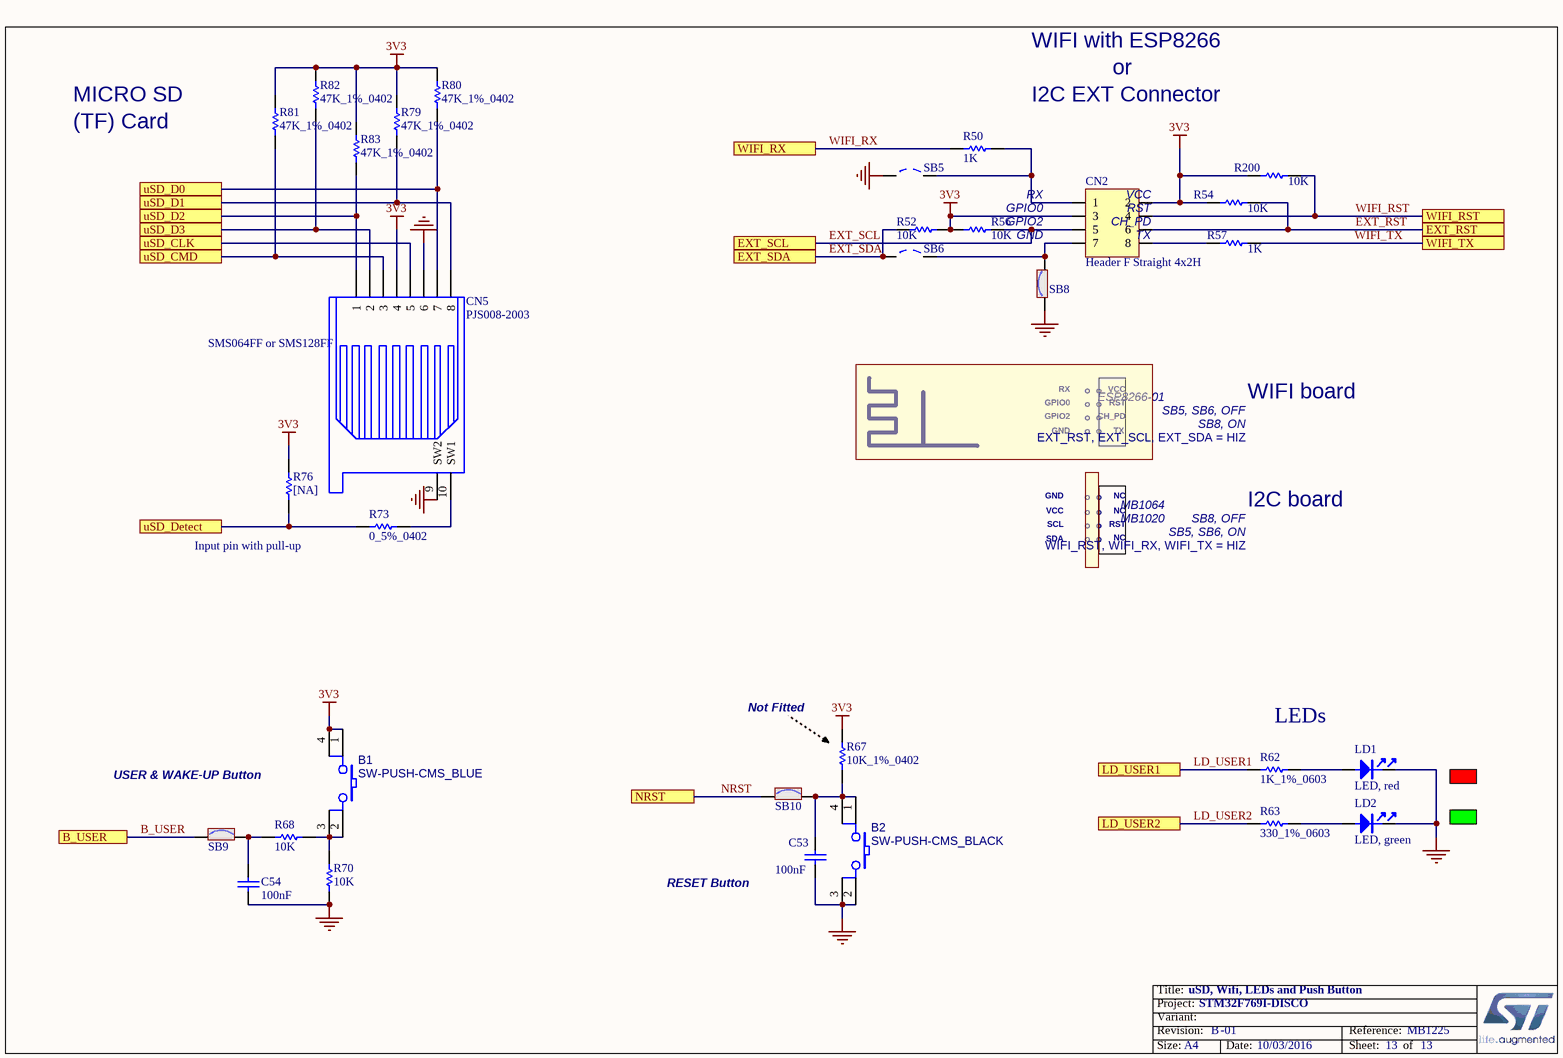
[diagram p4: Peripherals.SchDoc]

### Parts
B1  SW-PUSH-CMS_BLUE  [PB10]
B2  SW-PUSH-CMS_BLACK  [PB10]
C53  100nF  [0402C]
C54  100nF  [0402C]
CN2  Header F Straight 4x2H  [HDR_2X4_2R54]
CN5  PJS008-2003  [MSD_PJS008_]
LD1  LED, red  [0603D]
LD2  LED, green  [0603D]
R50  1K  [0402R]
R52  10K  [0402R]
R54  10K  [0402R]
R56  10K  [0402R]
R57  1K  [0402R]
R62  1K_1%_0603  [0603R]
R63  330_1%_0603  [0603R]
R67  10K_1%_0402  [0402R]
R68  10K  [0402R]
R70  10K  [0402R]
R73  0_5%_0402  [0402R]
R76  [NA]  [0402R]
R79  47K_1%_0402  [0402R]
R80  47K_1%_0402  [0402R]
R81  47K_1%_0402  [0402R]
R82  47K_1%_0402  [0402R]
R83  47K_1%_0402  [0402R]
R200  10K  [0402R]
SB5  Solder Bridge OFF  [JP2_SMD]  (value not drawn)
SB6  Solder Bridge OFF  [JP2_SMD]  (value not drawn)
SB8  Solder Bridge ON  [JP2_SMD]  (value not drawn)
SB9  Solder Bridge ON  [JP2_SMD]  (value not drawn)
SB10  Solder Bridge ON  [JP2_SMD]  (value not drawn)

### Ports
B_USER, EXT_RST, EXT_SCL, EXT_SDA, LD_USER1, LD_USER2, NRST, uSD_CLK, uSD_CMD, uSD_D0, uSD_D1, uSD_D2, uSD_D3, uSD_Detect, WIFI_RST, WIFI_RX, WIFI_TX

### Nets
3V3: B1.1 B1.4 CN2.2 CN2.3 CN5.4 R52.2 R54.1 R56.1 R67.2 R76.2 R79.2 R80.2 R81.2 R82.2 R83.2 R200.1
GND: B2.2 B2.3 C53.1 C54.1 CN5.6 CN5.9(SW2) LD1.2 LD2.2 R70.1 SB5.1 SB8.1  [project net POE7]
B_USER: SB9.1 ; port B_USER
EXT_RST: CN2.6 R54.2 ; port EXT_RST
EXT_SCL: CN2.5 R56.2 ; port EXT_SCL
EXT_SDA: R52.1 SB6.1 ; port EXT_SDA
LD_USER1: R62.1 ; port LD_USER1
LD_USER2: R63.1 ; port LD_USER2
NRST: SB10.1 ; port NRST
PB4: CN5.2 R82.1 ; port uSD_D3
PD6: CN5.5 ; port uSD_CLK
PD7: CN5.3 R81.1 ; port uSD_CMD
PG9: CN5.7 R80.1 ; port uSD_D0
PG10: CN5.8 R79.1 ; port uSD_D1
PI15: R73.1 R76.1 ; port uSD_Detect
uSD_D2: CN5.1 R83.1 ; port uSD_D2
WIFI_RST: CN2.4 R200.2 ; port WIFI_RST  [project net PJ14]
WIFI_RX: R50.1 ; port WIFI_RX  [project net PC12]
WIFI_TX: R57.2 ; port WIFI_TX  [project net PD2]
NetB1_2: B1.2 B1.3 R68.2 R70.2
NetB2_1: B2.1 B2.4 C53.2 R67.1 SB10.2
NetC54_2: C54.2 R68.1 SB9.2
NetCN2_1: CN2.1 R50.2 SB5.2
NetCN2_7: CN2.7 SB6.2 SB8.2
NetCN2_8: CN2.8 R57.1
NetCN5_10: CN5.10(SW1) R73.2
NetLD1_1: LD1.1 R62.2
NetLD2_1: LD2.1 R63.2

### Notes on the sheet
- WIFI with ESP8266
- MICRO SD
- (TF) Card
- I2C EXT Connector
- or
- (near CN2) RX
- (near CN2) VCC
- GND
- (near CN2) GPIO2
- (near CN2) GPIO0
- (near CN2) CH_PD
- (near CN2) RST
- (near CN2) TX
- (near CN5) SMS064FF or SMS128FF
- GPIO0
- RX
- ° °
- VCC
- RST
- ESP8266-01
- WIFI board
- GPIO2
- TX
- CH_PD
- SB5, SB6, OFF
- SB8, ON
- EXT_RST, EXT_SCL, EXT_SDA = HIZ
- SCL
- SDA
- NC
- MB1064
- MB1020
- I2C board
- SB8, OFF
- SB5, SB6, ON
- Input pin with pull-up
- WIFI_RST, WIFI_RX, WIFI_TX = HIZ
- (near R67) Not Fitted
- LEDs
- USER & WAKE-UP Button
- RESET Button
- Title:
- Project:
- Size:
- Revision:
- Variant:
- A4
- -
- Date:
- Reference:
- Sheet:
- of

### Library data of the parts
B1 = SW-PUSH-CMS_BLUE: Non-Open Push-Button 0.1A 24V; Manuf_2: FARNELL; Manuf_Part_2: 535-930; Manuf_1: wealthmetal; Manuf_Part_1: TD0341X-G01-BLU; Ref St: 9180120; SMEE_FP: BP1CMS; Provided: Sub Co; Distrib: Sub Co; ECCN_US/EU: n/a; SOFER_FP: PB10
B2 = SW-PUSH-CMS_BLACK: Non-Open Push-Button 0.1A 24V; Manuf_2: FARNELL; Manuf_Part_2: 535-930; Manuf_1: wealthmetal; Manuf_Part_1: TD0341X-G01-BLA; Ref St: 9180120; SMEE_FP: BP1CMS; SOFER_FP: BP10; Provided: Sub Co; Distrib: Sub Co; ECCN_US/EU: n/a
C53 C54 = Cap_100nF_X7R_10%_0402: as C42 on sheet ST_LINK_V2-1; Revision: July-2002: Re-released for DXP Platform.; Value: 100nF; Order: CC0402KRX7R7BB104; Manuf_1: YAGEO
CN2 = Header 4X2F: Header Female, 4-Pin, Dual row, Straight; Manuf_Part_1: BL 2-8G; Manuf_1: Fischer Electronik; Distrib: Sub Co; Footprint: HDR2X4H; ECCN_US/EU: n/a
CN5 = microSD-PJS008-2003: Memory Card Connectors MicroSD Card Conn Revrs Mnt Push-Push; Manuf_Part_1: PJS008-2003-1; Manuf_1: YAMAICHI; Distrib: Sub Co; Order: PJS008-2003-1; ECCN_US/EU: n/a
LD1 = LED_red: as LD6 on sheet ST_LINK_V2-1; Order: 19-213-R6C-AP1Q2B/3T
LD2 = LED_green: LED, green, 0603; Manuf_1: everlight; Manuf_Part_1: 19-213SYGC/S530-E2/TR8; ECCN_US/EU: EAR99/NEC; Order: 19-213SYGC/S530-E2/TR8
R50 R57 = Res_1K_1%_0402: as R58 on sheet ST_LINK_V2-1; Value: 1K; Manuf_1: YAGEO; Order: RC0402FR-071KL; ECCN_US/EU: n/a
R52 R54 R56 R68 R70 R200 = Res_10K_1%_0402: as R122 on sheet ST_LINK_V2-1; Value: 10K; Manuf_1: YAGEO; Order: RC0402FR-0710KL; ECCN_US/EU: n/a
R62 = Res_1K_1%_0603: Resistor,1K,0603,1%,YAGEO; Manuf_Part_1: RC0603FR-071KL; Value: 1K; Manuf_1: YAGEO; Order: RC0603FR-071KL; ECCN_US/EU: n/a
R63 = Res_330_1%_0603: Resistor,330,0603,1%,YAGEO; Manuf_Part_1: RC0603FR-07330RL; Manuf_Part_2: RT0603FRE07330RL; Value: 330; ECCN_US/EU: n/a; Manuf_1: YAGEO; Distrib: FARNELL; Manuf_2: YAGEO
R67 = Res_10K_1%_0402: Resistor,10K,0402,1%,YAGEO; Manuf_Part_1: RC0402FR-0710KL; Fitted: NO; Value: 10K; Manuf_1: YAGEO; Order: RC0402FR-0710KL; ECCN_US/EU: n/a
R73 = Res_0_5%_0402: Resistor,0,0402,5%,YAGEO; Manuf_Part_1: RC0402JR-070RL; Value: 0; Order: 2363467; ECCN_US/EU: n/a; Manuf_1: YAGEO; Distrib: FARNELL
R76 = Res_NA_0402: Resistor,[NA],0402; Fitted: NO; Value: [NA]; ECCN_US/EU: n/a
R79-R83 = Res_47K_1%_0402: Resistor,47K,0402,1%,YAGEO; Manuf_Part_1: RC0402FR-0747KL; Order: 9239430; Value: 47K; Manuf_1: YAGEO; ECCN_US/EU: n/a; Distrib: FARNELL
SB5 SB6 = SB_OFF: Solder: NO; Revision: July-2002: Re-released for DXP Platform.; ECCN_US/EU: n/a
SB8-SB10 = SB_ON: Solder: YES; Revision: July-2002: Re-released for DXP Platform.; ECCN_US/EU: n/a

## Sheet QSPI.SchDoc: Quad SPI Flash Memory (MICRON)
size A4; Date: 29-OCT-2015; Author: A.B; CompanyName: STMicroelectronics; Organization: MCD/TOOLS/GNB; Address1: 12, Rue Jules HOROWITZ; Address2: 38019 Grenoble; Address3: FRANCE; DocumentNumber: MB1225; Revision: B-01; SheetNumber: 7; SheetTotal: 13; Project: STM32F769I-DISCO
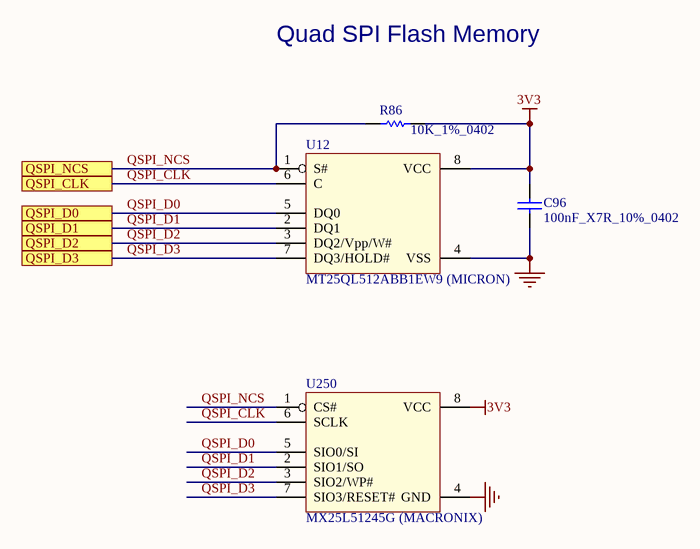
[diagram p5: QSPI.SchDoc]

### Parts
C96  100nF_X7R_10%_0402  [0402C]
R86  10K_1%_0402  [0402R]
U12  MT25QL512ABB1EW9 (MICRON)  [DFN8_1R27_6X8_TP4R8X5R16]
U250  MX25L51245G (MACRONIX)  [SON8_1R27_6X8]

### Ports
QSPI_CLK, QSPI_D0, QSPI_D1, QSPI_D2, QSPI_D3, QSPI_NCS

### Nets
3V3: C96.2 R86.2 U12.8(VCC) U250.8(VCC)
GND: C96.1 U12.4(VSS) U250.4(GND)  [project net POE7]
QSPI_CLK: U12.6(C) U250.6(SCLK) ; port QSPI_CLK  [project net PB2]
QSPI_D0: U12.5(DQ0) U250.5(SIO0/SI) ; port QSPI_D0  [project net PC9]
QSPI_D1: U12.2(DQ1) U250.2(SIO1/SO) ; port QSPI_D1  [project net PC10]
QSPI_D2: U12.3(DQ2/Vpp/W#) U250.3(SIO2/WP#) ; port QSPI_D2  [project net PE2]
QSPI_D3: U12.7(DQ3/HOLD#) U250.7(SIO3/RESET#) ; port QSPI_D3  [project net PD13]
QSPI_NCS: R86.1 U12.1(S#) U250.1(CS#) ; port QSPI_NCS  [project net PB6]

### Notes on the sheet
- Quad SPI Flash Memory
- Title:
- Project:
- Size:
- Revision:
- Variant:
- A4
- -
- Date:
- Reference:
- Sheet:
- of

### Library data of the parts
C96 = Cap_100nF_X7R_10%_0402: as C42 on sheet ST_LINK_V2-1; Revision: July-2002: Re-released for DXP Platform.; Value: 100nF; Order: CC0402KRX7R7BB104; Manuf_1: YAGEO; ECCN_US/EU: n/a
R86 = Res_10K_1%_0402: as R122 on sheet ST_LINK_V2-1; Value: 10K; Manuf_1: YAGEO; Order: RC0402FR-0710KL; ECCN_US/EU: n/a
U12 = MT25QL512ABB1EW9: 512Mb, 3V, Multiple I/O Serial Flash Memory, Quad/Dual; Manuf_Part_2: N25Q512A13GF840E; Manuf_Part_1: MT25QL512ABB1EW9-0SIT; ECCN_US/EU: 3A991/NEC; Provided: ST; Ref St: xxxxxxxx; Note: MX25L51245GZ2I-08G can also be use but with a different footprint; Fitted: NO; Manuf_1: MICRON; Distrib: MICRON
U250 = MX25L51245G: 512Mb, 3V, Multiple I/O Serial Flash Memory, Quad/Dual; Manuf_Part_1: MX25L51245GZ2I-08G; Manuf_Part_2: MX25L51245GZ2I-10G; ECCN_US/EU: 3A991/NEC; Provided: Sub Co; Ref St: xxxxxxxxxx; Note: MT25QL512ABB1EW9 can be also used but with a different footprint; Manuf_1: MACRONIX; Distrib: MACRONIX

## Sheet Arduino_ Connectors.SchDoc: Arduino UNO connectors
size A4; Date: 29-OCT-2015; Author: A.B; CompanyName: STMicroelectronics; Organization: MCD/TOOLS/GNB; Address1: 12, Rue Jules HOROWITZ; Address2: 38019 Grenoble; Address3: FRANCE; DocumentNumber: MB1225; Revision: B-01; SheetNumber: 8; SheetTotal: 13; Project: STM32F769I-DISCO
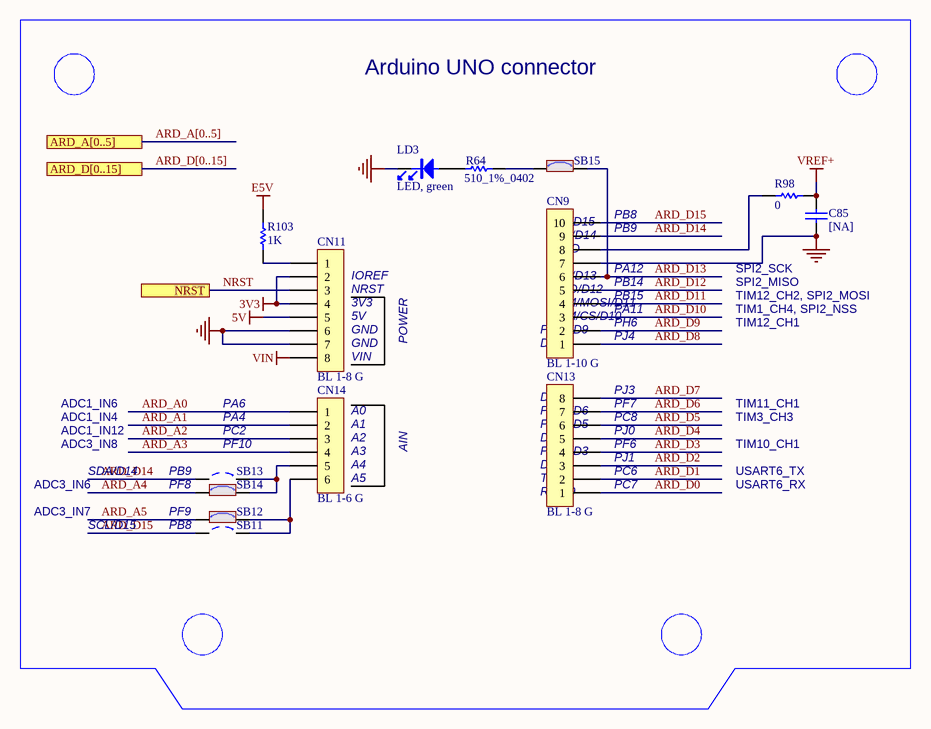
[diagram p6: Arduino_ Connectors.SchDoc]

### Parts
C85  [NA]  [0402C]
CN9  BL 1-10 G  [HDR_1X10_2R54_W]
CN11  BL 1-8 G  [HDR_1X8_2R54_W]
CN13  BL 1-8 G  [HDR_1X8_2R54_W]
CN14  BL 1-6 G  [HDR_1X6_2R54_W]
LD3  LED, green  [0603D]
R64  510_1%_0402  [0402R]
R98  0  [0402R]
R103  1K  [0402R]
SB11  Solder Bridge OFF  [JP2_SMD]  (value not drawn)
SB12  Solder Bridge ON  [JP2_SMD]  (value not drawn)
SB13  Solder Bridge OFF  [JP2_SMD]  (value not drawn)
SB14  Solder Bridge ON  [JP2_SMD]  (value not drawn)
SB15  Solder Bridge ON  [JP2_SMD]  (value not drawn)

### Ports
ARD_A[0..5], ARD_D[0..15], NRST

### Nets
3V3: CN11.2 CN11.4
5V: CN11.5
E5V: R103.2
GND: C85.1 CN9.7 CN11.6 CN11.7 LD3.2  [project net POE7]
VIN: CN11.8
VREF+: C85.2 R98.2
ARD_A0: CN14.1
ARD_A1: CN14.2
ARD_A2: CN14.3
ARD_A3: CN14.4
ARD_A4: SB14.1
ARD_A5: SB12.1
ARD_D0: CN13.1
ARD_D1: CN13.2
ARD_D2: CN13.3
ARD_D3: CN13.4
ARD_D4: CN13.5
ARD_D5: CN13.6
ARD_D6: CN13.7
ARD_D7: CN13.8
ARD_D8: CN9.1
ARD_D9: CN9.2
ARD_D10: CN9.3
ARD_D11: CN9.4
ARD_D12: CN9.5
ARD_D13: CN9.6 SB15.2
ARD_D14: CN9.9 SB13.1
ARD_D15: CN9.10 SB11.1
NRST: CN11.3 ; port NRST
NetCN9_8: CN9.8 R98.1
NetCN11_1: CN11.1 R103.1
NetCN14_5: CN14.5 SB13.2 SB14.2
NetCN14_6: CN14.6 SB11.2 SB12.2
NetLD3_1: LD3.1 R64.1
NetR64_2: R64.2 SB15.1

### Buses and harness runs
bus ARD_A[0..5] = port ARD_A[0..5]
bus ARD_D[0..15] = port ARD_D[0..15]

### Notes on the sheet
- Arduino UNO connector
- PB8
- (near CN11) IOREF
- (near CN11) NRST
- (near CN9) SDA/D14
- (near CN9) SCL/D15
- (near CN9) SCK/D13
- (near CN9) MISO/D12
- (near CN9) AVDD
- (near CN9) GND
- (near CN9) PB14
- (near CN9) PA12
- (near CN9) PB9
- SPI2_MISO
- SPI2_SCK
- (near CN11) 3V3
- (near CN11) 5V
- (near CN11) GND
- POWER
- (near CN9) D8
- (near CN9) PWM/D9
- (near CN9) PWM/CS/D10
- (near CN9) PWM/MOSI/D11
- (near CN9) PA11
- (near CN9) PJ4
- (near CN9) PH6
- (near CN9) PB15
- TIM12_CH1
- TIM1_CH4, SPI2_NSS
- TIM12_CH2, SPI2_MOSI
- ADC1_IN4
- ADC1_IN6
- PA6
- PA4
- (near CN14) A0
- (near CN14) A1
- (near CN11) VIN
- (near CN13) PWM/D5
- (near CN13) PWM/D6
- (near CN13) D7
- (near CN13) PF7
- PJ3
- (near CN13) PC8
- TIM3_CH3
- TIM11_CH1
- ADC3_IN6
- ADC3_IN8
- ADC1_IN12
- SDA/D14
- PB9
- PF8
- PC2
- PF10
- (near CN14) A2
- (near CN14) A3
- (near CN14) A4
- (near CN14) A5
- AIN
- (near CN13) TX/D1
- (near CN13) D2
- (near CN13) D4
- (near CN13) PWM/D3
- (near CN13) PC6
- (near CN13) PJ1
- (near CN13) PF6
- (near CN13) PJ0
- (near CN13) PC7
- USART6_RX
- USART6_TX
- TIM10_CH1
- ADC3_IN7
- SCL/D15
- PF9
- (near CN13) RX/D0
- Title:
- Project:
- Size:
- Revision:
- Variant:
- -
- Date:
- Reference:
- Sheet:
- of

### Library data of the parts
C85 = Cap_NA_0402: Capacitor,NA,0402; Fitted: NO; Revision: July-2002: Re-released for DXP Platform.; Value: [NA]; ECCN_US/EU: n/a
CN9 = Header 10X1_Female_THT: Header, 10-Pin, Single row, female, THT, 2.54; Manuf_1: Fischer Electronik; Manuf_Part_1: BL 1-10 G; Distrib: Sub Co; ECCN_US/EU: n/a
CN11 CN13 = Header 8X1_Female_THT: Header, 8-Pins, Single row, female, THT, 2.54; Manuf_1: Fischer Electronik; Manuf_Part_1: BL 1-8 G; Distrib: Sub Co; ECCN_US/EU: n/a
CN14 = Header 6X1_Female_THT: Header, 6-Pins, Single row, female THT, 2.54; Manuf_1: Fischer Electronik; Manuf_Part_1: BL 1-6 G; Distrib: Sub Co; ECCN_US/EU: n/a
LD3 = LED_green: as LD2 on sheet Peripherals; Order: 19-213SYGC/S530-E2/TR8
R64 = Res_510_1%_0402: Resistor,510,0402,1%,YAGEO; Manuf_Part_1: RC0402FR-07510L; Value: 510; Manuf_1: YAGEO; Order: RC0402FR-07510L; ECCN_US/EU: n/a; Distrib: DIGIKEY
R98 = Res_0_5%_0402: as R88 on sheet AUDIO; Value: 0; ECCN_US/EU: n/a; Manuf_1: YAGEO; Distrib: FARNELL
R103 = Res_1K_1%_0402: as R58 on sheet ST_LINK_V2-1; Value: 1K; Manuf_1: YAGEO; Order: RC0402FR-071KL; ECCN_US/EU: n/a
SB11 SB13 = SB_OFF: Solder: NO; Revision: July-2002: Re-released for DXP Platform.; ECCN_US/EU: n/a
SB12 SB14 SB15 = SB_ON: Solder: YES; Revision: July-2002: Re-released for DXP Platform.; ECCN_US/EU: n/a